# EAGLE design BCN3D++ (EAGLE 6.6.0)
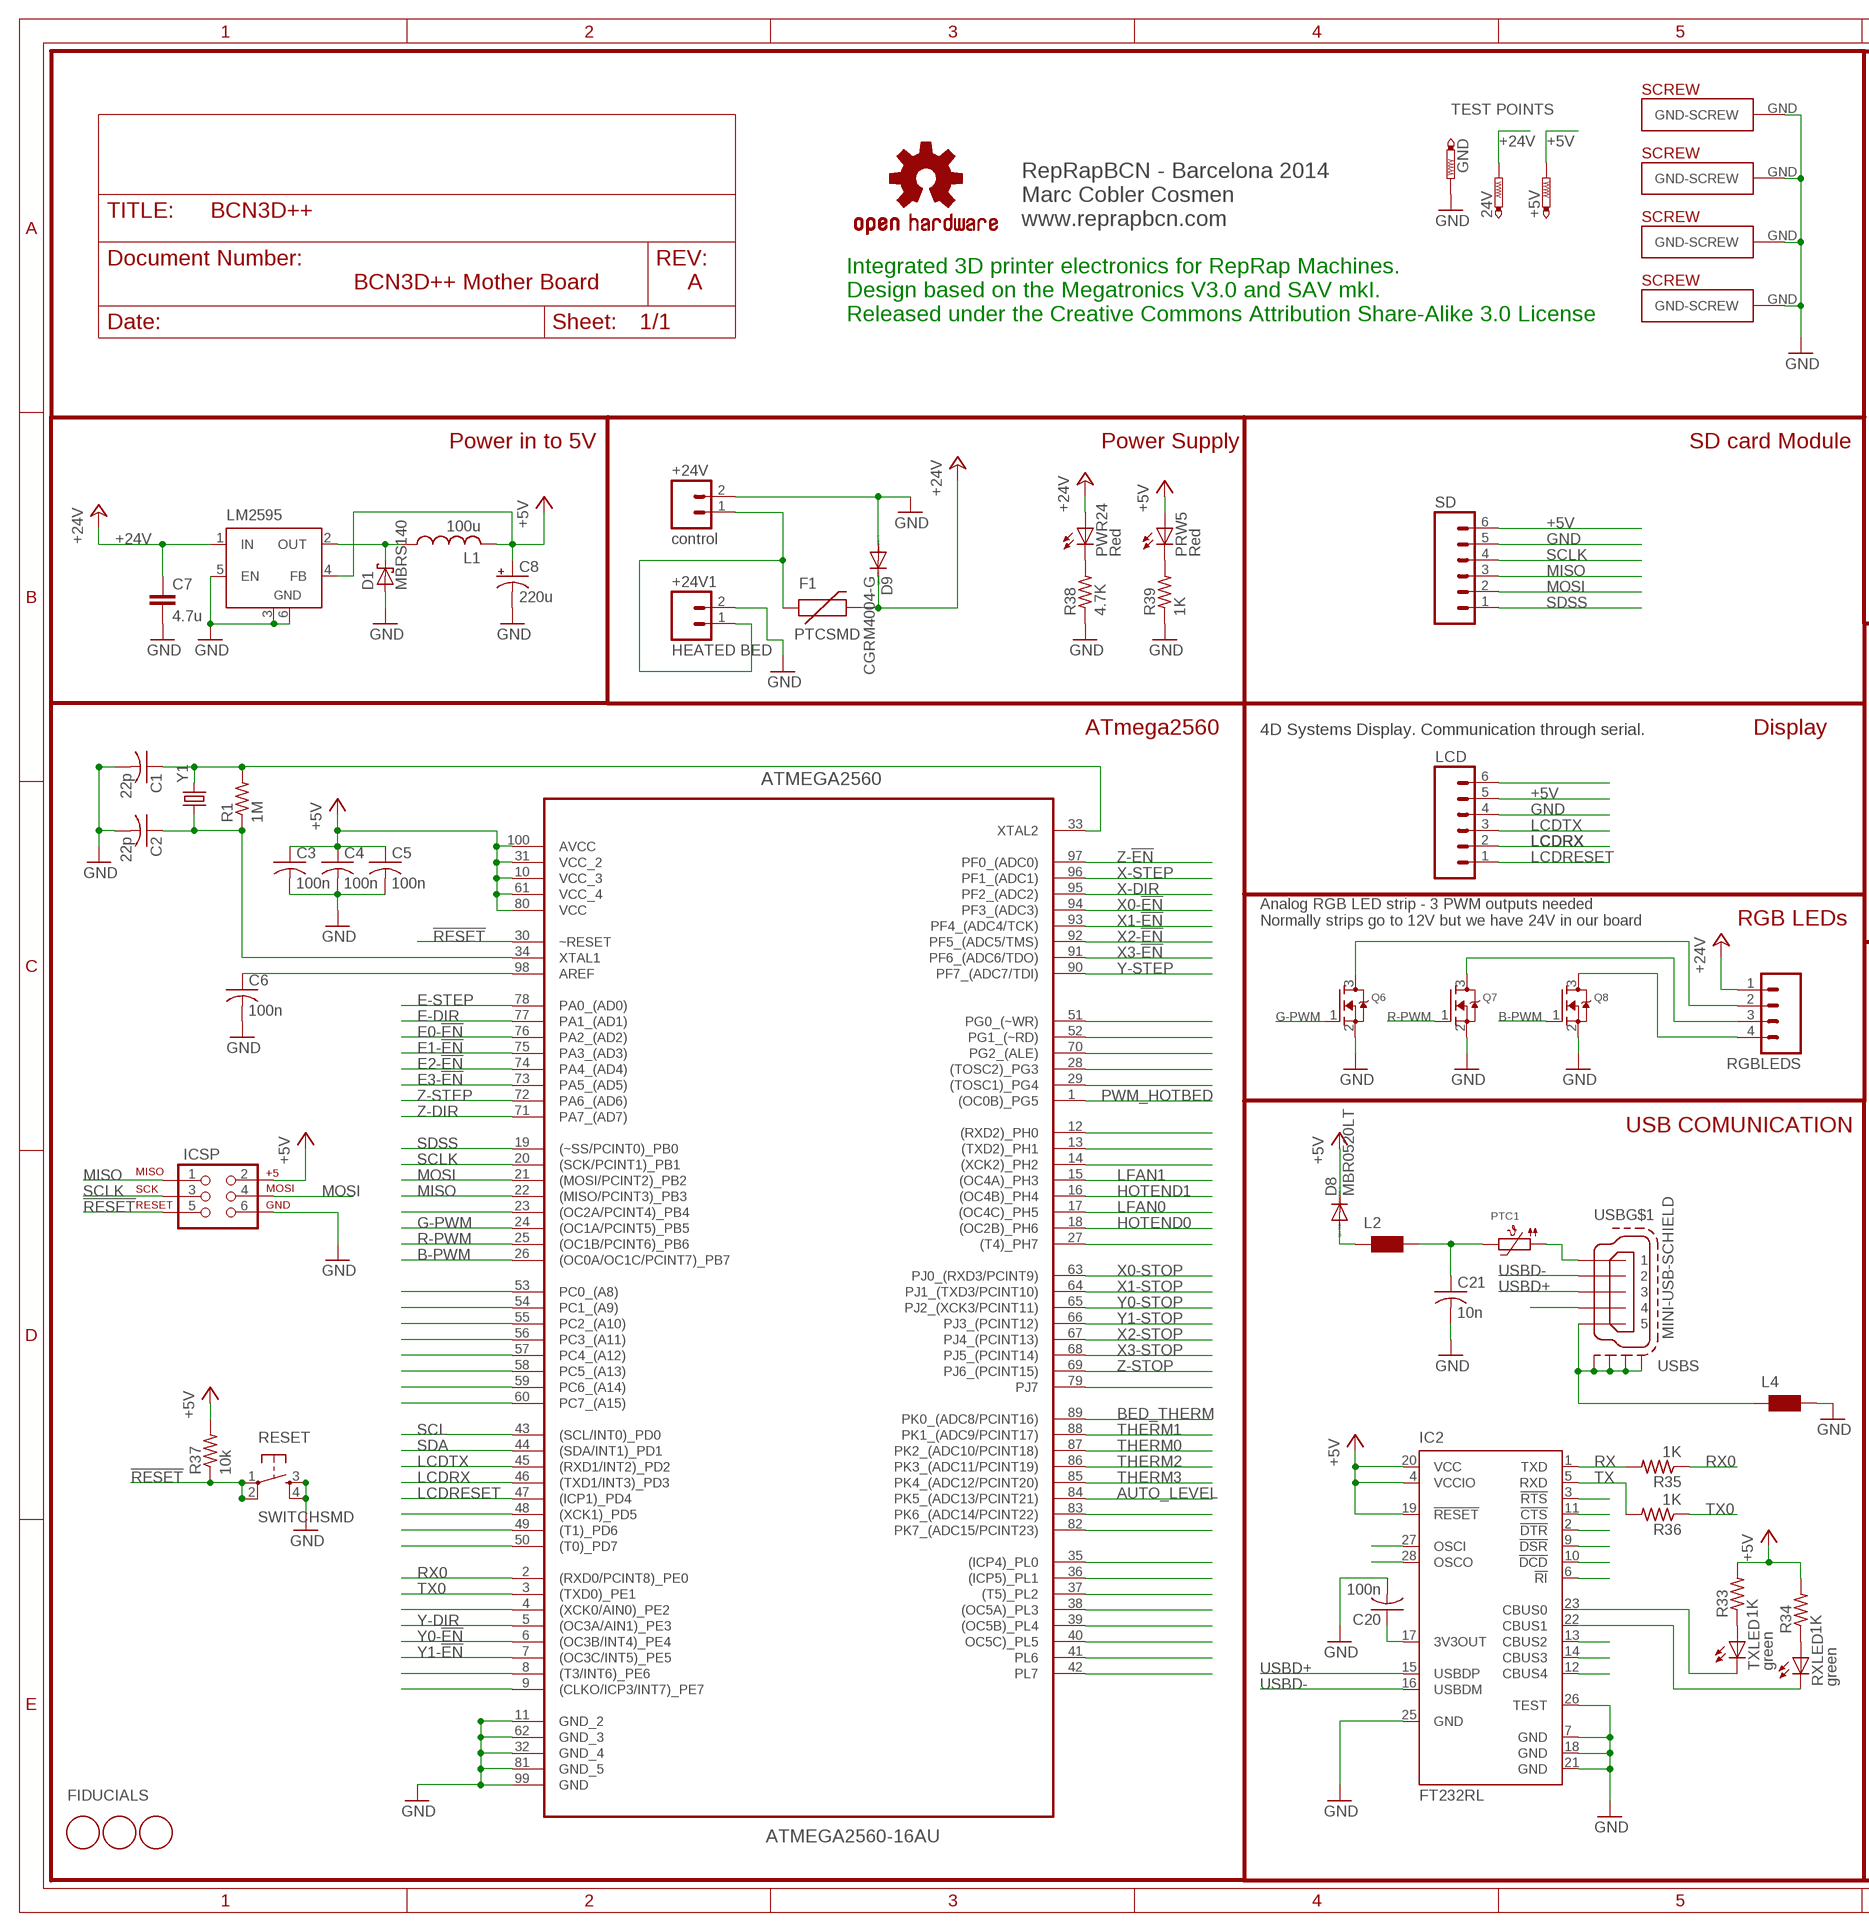
[diagram p0: schematic, sheet 1, part 1 of 2]
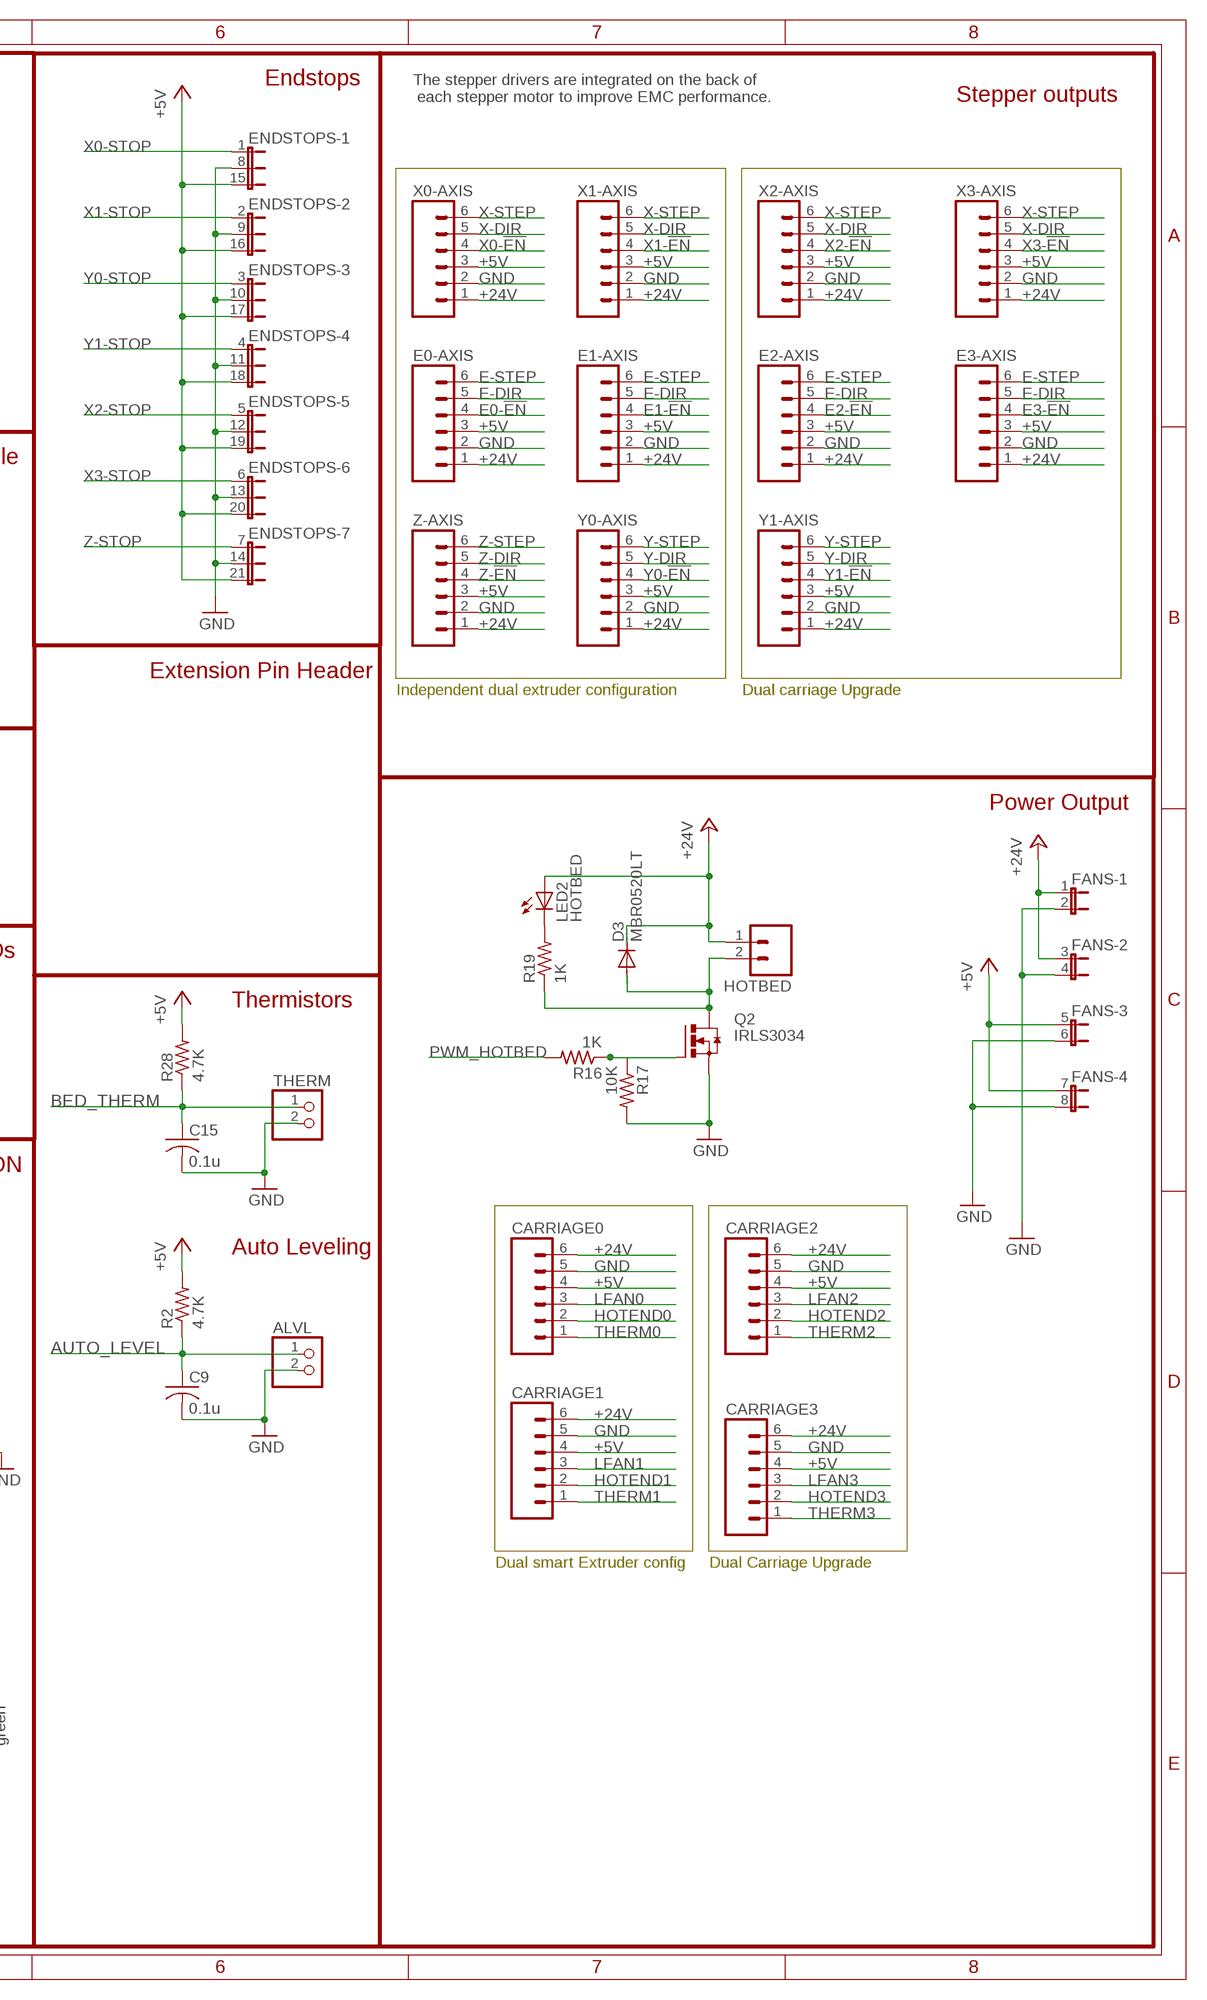
[diagram p1: schematic, sheet 1, part 2 of 2]

## Parts
24V  PTR1TP12SQ  [TP12SQ]
+5V  PTR1TP12SQ  [TP12SQ]
+24V  control  M025MM  [SCREWTERMINAL-5MM-2]
+24V1  HEATED BED  M025MM  [SCREWTERMINAL-5MM-2]
ALVL  PINHD-1X2  [1X02]
ATMEGA2560  ATMEGA2560-16AU  [QFP50P1600X1600X120-100N]
C1  22p  C-USC0805  [C0805]
C2  22p  C-USC0805  [C0805]
C3  100n  C-USC0805  [C0805]
C4  100n  C-USC0805  [C0805]
C5  100n  C-USC0805  [C0805]
C6  100n  C-USC0805  [C0805]
C7  4.7u  C-EUC1206K  [C1206K]
C8  220u  CPOL-USUD-8X10  [UD-8X10_NICHICON]
C9  0.1u  C-USC0805  [C0805]
C15  0.1u  C-USC0805  [C0805]
C20  100n  C-USC0805  [C0805]
C21  10n  C-USC0805K  [C0805K]
CARRIAGE0  M06SIP  [1X06]
CARRIAGE1  M06SIP  [1X06]
CARRIAGE2  M06SIP  [1X06]
CARRIAGE3  M06SIP  [1X06]
D1  MBRS140  SHOTTKY-DIODESMBRS140  [DO-214AA]
D3  MBR0520LT  [SOD123]
D8  MBR0520LT  [SOD123]
D9  CGRM4004-G  [SOD-123_MINI-SMA]
E0-AXIS  M06SIP  [1X06]
E1-AXIS  M06SIP  [1X06]
E2-AXIS  M06SIP  [1X06]
E3-AXIS  M06SIP  [1X06]
ENDSTOPS  PINCONNECTOR-7X3  [MALE-PIN-3X7]
F1  PTCSMD  [PTC-1206]
FANS  JP4QE  [JP4Q]
FID1  FIDUCIAL  [FIDUCIAL_1MM]
FID2  FIDUCIAL  [FIDUCIAL_1MM]
FID3  FIDUCIAL  [FIDUCIAL_1MM]
GND  PTR1TP12SQ  [TP12SQ]
HOTBED  M025MM  [SCREWTERMINAL-5MM-2]
IC2  FT232RL  [SSOP28]
ICSP  AVR_SPI_PRG_6NS  [2X3-NS]
L1  100u  INDUCTANCE  [SSR1260]
L2  WUERTH-ELEKTRONIK_WE-CBF_1206W  [WUERTH-ELEKTRONIK_1206W]
L4  WUERTH-ELEKTRONIK_WE-CBF_1206W  [WUERTH-ELEKTRONIK_1206W]
LCD  M06SIP  [1X06]
LED2  HOTBED  LEDCHIP-LED0603  [CHIP-LED0603]
LM2595  LM2596S  [TO263-5]
LOGO1  OSHW-LOGOM  [OSHW-LOGO-M]
PRW5  Red  LEDCHIP-LED0805  [CHIP-LED0805]
PTC1  MICROBUILDER_PTC1206_L  [MICROBUILDER_1206_PTC]
PWR24  Red  LEDCHIP-LED0805  [CHIP-LED0805]
Q2  IRLS3034  IRF3704S  [D2PACK]
Q6  MOSFET-NREFLOW  [SOT23]
Q7  MOSFET-NREFLOW  [SOT23]
Q8  MOSFET-NREFLOW  [SOT23]
R1  1M  R-US_R0805  [R0805]
R2  4.7K  R-US_M0805  [M0805]
R16  1K  R-US_M0805  [M0805]
R17  10K  R-US_M0805  [M0805]
R19  1K  R-US_M0805  [M0805]
R28  4.7K  R-US_M0805  [M0805]
R33  1K  R-US_M0805  [M0805]
R34  1K  R-US_M0805  [M0805]
R35  1K  R-US_M0805  [M0805]
R36  1K  R-US_M0805  [M0805]
R37  10k  R-US_M0805  [M0805]
R38  4.7K  R-US_R0805  [R0805]
R39  1K  R-US_R0805  [R0805]
RESET  SWITCHSMD  TAC_SWITCHSMD  [TACTILE-SWITCH-SMD]
RGBLEDS  M04PTH  [1X04]
RXLED  green  LEDCHIP-LED0603  [CHIP-LED0603]
SD  M06SIP  [1X06]
THERM  PINHD-1X2  [1X02]
TXLED  green  LEDCHIP-LED0603  [CHIP-LED0603]
U$1  SANGUINOLOLU_PLATED-SCREW  [SANGUINOLOLU_PLATEDSCREW]
U$2  SANGUINOLOLU_PLATED-SCREW  [SANGUINOLOLU_PLATEDSCREW]
U$3  SANGUINOLOLU_PLATED-SCREW  [SANGUINOLOLU_PLATEDSCREW]
U$4  SANGUINOLOLU_PLATED-SCREW  [SANGUINOLOLU_PLATEDSCREW]
USB  MINI-USB-SCHIELD  MINI-USB-SCHIELD-32005-201  [32005-201]
X0-AXIS  M06SIP  [1X06]
X1-AXIS  M06SIP  [1X06]
X2-AXIS  M06SIP  [1X06]
X3-AXIS  M06SIP  [1X06]
Y0-AXIS  M06SIP  [1X06]
Y1  CRYSTALHC49US  [HC49US]
Y1-AXIS  M06SIP  [1X06]
Z-AXIS  M06SIP  [1X06]

## Nets
11111: ATMEGA2560.23((OC2A/PCINT4)_PB4)
!RESET: ATMEGA2560.30(~RESET) ICSP.5 R37.1 RESET.1 RESET.2
+5V: +5V.TP ATMEGA2560.10(VCC_3) ATMEGA2560.31(VCC_2) ATMEGA2560.61(VCC_4) ATMEGA2560.80(VCC) ATMEGA2560.100(AVCC) C3.1 C4.1 C5.1 C8.+ CARRIAGE0.4 CARRIAGE1.4 CARRIAGE2.4 CARRIAGE3.4 D8.C E0-AXIS.3 E1-AXIS.3 E2-AXIS.3 E3-AXIS.3 ENDSTOPS.15 ENDSTOPS.16 ENDSTOPS.17 ENDSTOPS.18 ENDSTOPS.19 ENDSTOPS.20 ENDSTOPS.21 FANS.5 FANS.7 IC2.4(VCCIO) IC2.19(!RESET) IC2.20(VCC) ICSP.2 L1.B LCD.5 LM2595.4(FB) PRW5.A R2.2 R28.2 R33.2 R34.2 R37.2 SD.6 X0-AXIS.3 X1-AXIS.3 X2-AXIS.3 X3-AXIS.3 Y0-AXIS.3 Y1-AXIS.3 Z-AXIS.3
+24V: 24V.TP C7.1 CARRIAGE0.6 CARRIAGE1.6 CARRIAGE2.6 CARRIAGE3.6 D3.C D9.C E0-AXIS.1 E1-AXIS.1 E2-AXIS.1 E3-AXIS.1 F1.2 FANS.1 FANS.3 HOTBED.1 LED2.A LM2595.1(IN) PWR24.A RGBLEDS.1 X0-AXIS.1 X1-AXIS.1 X2-AXIS.1 X3-AXIS.1 Y0-AXIS.1 Y1-AXIS.1 Z-AXIS.1
AUTO_LEVEL: ALVL.1 ATMEGA2560.84(PK5_(ADC13/PCINT21)) C9.1 R2.1
B-PWM: ATMEGA2560.26((OC0A/OC1C/PCINT7)_PB7) Q8.1(G)
BED_THERM: ATMEGA2560.89(PK0_(ADC8/PCINT16)) C15.1 R28.1 THERM.1
E0-!EN: ATMEGA2560.76(PA2_(AD2)) E0-AXIS.4
E1-!EN: ATMEGA2560.75(PA3_(AD3)) E1-AXIS.4
E2-!EN: ATMEGA2560.74(PA4_(AD4)) E2-AXIS.4
E3-!EN: ATMEGA2560.73(PA5_(AD5)) E3-AXIS.4
E-DIR: ATMEGA2560.77(PA1_(AD1)) E0-AXIS.5 E1-AXIS.5 E2-AXIS.5 E3-AXIS.5
E-STEP: ATMEGA2560.78(PA0_(AD0)) E0-AXIS.6 E1-AXIS.6 E2-AXIS.6 E3-AXIS.6
G-PWM: ATMEGA2560.24((OC1A/PCINT5)_PB5) Q6.1(G)
GND: +24V1.2 +24V.2 ALVL.2 ATMEGA2560.11(GND_2) ATMEGA2560.32(GND_4) ATMEGA2560.62(GND_3) ATMEGA2560.81(GND_5) ATMEGA2560.99(GND) C1.2 C2.2 C3.2 C4.2 C5.2 C6.2 C7.2 C8.- C9.2 C15.2 C20.2 C21.2 CARRIAGE0.5 CARRIAGE1.5 CARRIAGE2.5 CARRIAGE3.5 D1.A D9.A E0-AXIS.2 E1-AXIS.2 E2-AXIS.2 E3-AXIS.2 ENDSTOPS.8 ENDSTOPS.9 ENDSTOPS.10 ENDSTOPS.11 ENDSTOPS.12 ENDSTOPS.13 ENDSTOPS.14 FANS.2 FANS.4 FANS.6 FANS.8 GND.TP IC2.7(GND) IC2.18(GND) IC2.21(GND) IC2.25(GND) IC2.26(TEST) ICSP.6 L4.2 LCD.4 LM2595.3(GND) LM2595.5(EN) LM2595.6(GND) Q2.3(S) Q6.2(S) Q7.2(S) Q8.2(S) R17.2 R38.1 R39.1 RESET.3 RESET.4 SD.5 THERM.2 U$1.GND(GND-SCREW) U$2.GND(GND-SCREW) U$3.GND(GND-SCREW) U$4.GND(GND-SCREW) X0-AXIS.2 X1-AXIS.2 X2-AXIS.2 X3-AXIS.2 Y0-AXIS.2 Y1-AXIS.2 Z-AXIS.2
HOTEND0: ATMEGA2560.18((OC2B)_PH6) CARRIAGE0.2
HOTEND1: ATMEGA2560.16((OC4B)_PH4) CARRIAGE1.2
HOTEND2: CARRIAGE2.2
HOTEND3: CARRIAGE3.2
LCDRESET: ATMEGA2560.47((ICP1)_PD4) LCD.1
LCDRX: ATMEGA2560.46((TXD1/INT3)_PD3) LCD.2
LCDTX: ATMEGA2560.45((RXD1/INT2)_PD2) LCD.3
LFAN0: ATMEGA2560.17((OC4C)_PH5) CARRIAGE0.3
LFAN1: ATMEGA2560.15((OC4A)_PH3) CARRIAGE1.3
LFAN2: CARRIAGE2.3
LFAN3: CARRIAGE3.3
MISO: ATMEGA2560.22((MISO/PCINT3)_PB3) ICSP.1 SD.3
MOSI: ATMEGA2560.21((MOSI/PCINT2)_PB2) ICSP.4 SD.2
N$1: ATMEGA2560.33(XTAL2) C1.1 R1.2 Y1.2
N$2: ATMEGA2560.98(AREF) C6.1
N$3: ATMEGA2560.34(XTAL1) C2.1 R1.1 Y1.1
N$4: D1.C L1.A LM2595.2(OUT)
N$5: C21.1 L2.2 PTC1.2
N$6: IC2.23(CBUS0) TXLED.C
N$7: IC2.22(CBUS1) RXLED.C
N$8: IC2.3(!RTS)
N$9: Q6.3(D) RGBLEDS.2
N$10: Q7.3(D) RGBLEDS.3
N$11: Q8.3(D) RGBLEDS.4
N$12: IC2.11(!CTS)
N$13: IC2.2(!DTR)
N$14: IC2.9(!DSR)
N$15: IC2.10(!DCD)
N$16: IC2.6(!RI)
N$17: IC2.13(CBUS2)
N$18: IC2.14(CBUS3)
N$19: IC2.12(CBUS4)
N$20: IC2.27(OSCI)
N$21: IC2.28(OSCO)
N$22: USB.4
N$24: LCD.6
N$25: +24V1.1 +24V.1 F1.1
N$63: Q2.1(G) R16.1 R17.1
N$66: D3.A HOTBED.2 Q2.2(D) R19.1
N$69: LED2.C R19.2
N$76: C20.1 IC2.17(3V3OUT)
N$81: R33.1 TXLED.A
N$82: R34.1 RXLED.A
N$83: D8.A L2.1
N$84: PTC1.1 USB.1
N$91: ATMEGA2560.53(PC0_(A8))
N$92: ATMEGA2560.54(PC1_(A9))
N$93: ATMEGA2560.55(PC2_(A10))
N$94: ATMEGA2560.56(PC3_(A11))
N$95: ATMEGA2560.57(PC4_(A12))
N$96: ATMEGA2560.58(PC5_(A13))
N$97: ATMEGA2560.59(PC6_(A14))
N$98: ATMEGA2560.60(PC7_(A15))
N$104: ATMEGA2560.48((XCK1)_PD5)
N$105: ATMEGA2560.49((T1)_PD6)
N$106: ATMEGA2560.50((T0)_PD7)
N$109: ATMEGA2560.4((XCK0/AIN0)_PE2)
N$113: ATMEGA2560.8((T3/INT6)_PE6)
N$114: ATMEGA2560.9((CLKO/ICP3/INT7)_PE7)
N$123: ATMEGA2560.51(PG0_(~WR))
N$124: ATMEGA2560.52(PG1_(~RD))
N$125: ATMEGA2560.70(PG2_(ALE))
N$126: ATMEGA2560.28((TOSC2)_PG3)
N$127: ATMEGA2560.29((TOSC1)_PG4)
N$129: ATMEGA2560.12((RXD2)_PH0)
N$130: ATMEGA2560.13((TXD2)_PH1)
N$131: ATMEGA2560.14((XCK2)_PH2)
N$136: ATMEGA2560.27((T4)_PH7)
N$144: ATMEGA2560.79(PJ7)
N$151: ATMEGA2560.83(PK6_(ADC14/PCINT22))
N$152: ATMEGA2560.82(PK7_(ADC15/PCINT23))
N$153: ATMEGA2560.35((ICP4)_PL0)
N$154: ATMEGA2560.36((ICP5)_PL1)
N$155: ATMEGA2560.37((T5)_PL2)
N$156: ATMEGA2560.38((OC5A)_PL3)
N$157: ATMEGA2560.39((OC5B)_PL4)
N$158: ATMEGA2560.40(OC5C)_PL5)
N$159: ATMEGA2560.41(PL6)
N$160: ATMEGA2560.42(PL7)
N$161: PWR24.C R38.2
N$162: PRW5.C R39.2
PWM_HOTBED: ATMEGA2560.1((OC0B)_PG5) R16.2
R-PWM: ATMEGA2560.25((OC1B/PCINT6)_PB6) Q7.1(G)
RX: IC2.1(TXD) R35.2
RX0: ATMEGA2560.2((RXD0/PCINT8)_PE0) R35.1
SCL: ATMEGA2560.43((SCL/INT0)_PD0)
SCLK: ATMEGA2560.20((SCK/PCINT1)_PB1) ICSP.3 SD.4
SDA: ATMEGA2560.44((SDA/INT1)_PD1)
SDSS: ATMEGA2560.19((~SS/PCINT0)_PB0) SD.1
THERM0: ATMEGA2560.87(PK2_(ADC10/PCINT18)) CARRIAGE0.1
THERM1: ATMEGA2560.88(PK1_(ADC9/PCINT17)) CARRIAGE1.1
THERM2: ATMEGA2560.86(PK3_(ADC11/PCINT19)) CARRIAGE2.1
THERM3: ATMEGA2560.85(PK4_(ADC12/PCINT20)) CARRIAGE3.1
TX: IC2.5(RXD) R36.2
TX0: ATMEGA2560.3((TXD0)_PE1) R36.1
USBD+: IC2.15(USBDP) USB.3
USBD-: IC2.16(USBDM) USB.2
USBSHIELD: L4.1 USB.5 USB.M1(S:S1) USB.M2(S:S2) USB.M3(S:S3) USB.M4(S:S4)
X0-!EN: ATMEGA2560.94(PF3_(ADC3)) X0-AXIS.4
X0-STOP: ATMEGA2560.63(PJ0_(RXD3/PCINT9)) ENDSTOPS.1
X1-!EN: ATMEGA2560.93(PF4_(ADC4/TCK)) X1-AXIS.4
X1-STOP: ATMEGA2560.64(PJ1_(TXD3/PCINT10)) ENDSTOPS.2
X2-!EN: ATMEGA2560.92(PF5_(ADC5/TMS)) X2-AXIS.4
X2-STOP: ATMEGA2560.67(PJ4_(PCINT13)) ENDSTOPS.5
X3-!EN: ATMEGA2560.91(PF6_(ADC6/TDO)) X3-AXIS.4
X3-STOP: ATMEGA2560.68(PJ5_(PCINT14)) ENDSTOPS.6
X-DIR: ATMEGA2560.95(PF2_(ADC2)) X0-AXIS.5 X1-AXIS.5 X2-AXIS.5 X3-AXIS.5
X-STEP: ATMEGA2560.96(PF1_(ADC1)) X0-AXIS.6 X1-AXIS.6 X2-AXIS.6 X3-AXIS.6
Y0-!EN: ATMEGA2560.6((OC3B/INT4)_PE4) Y0-AXIS.4
Y0-STOP: ATMEGA2560.65(PJ2_(XCK3/PCINT11)) ENDSTOPS.3
Y1-!EN: ATMEGA2560.7((OC3C/INT5)_PE5) Y1-AXIS.4
Y1-STOP: ATMEGA2560.66(PJ3_(PCINT12)) ENDSTOPS.4
Y-DIR: ATMEGA2560.5((OC3A/AIN1)_PE3) Y0-AXIS.5 Y1-AXIS.5
Y-STEP: ATMEGA2560.90(PF7_(ADC7/TDI)) Y0-AXIS.6 Y1-AXIS.6
Z-!EN: ATMEGA2560.97(PF0_(ADC0)) Z-AXIS.4
Z-DIR: ATMEGA2560.71(PA7_(AD7)) Z-AXIS.5
Z-STEP: ATMEGA2560.72(PA6_(AD6)) Z-AXIS.6
Z-STOP: ATMEGA2560.69(PJ6_(PCINT15)) ENDSTOPS.7

## Notes on the sheet
- Endstops
- The stepper drivers are integrated on the back of
   each stepper motor to improve EMC performance.
- Stepper outputs
- TEST POINTS
- RepRapBCN - Barcelona 2014
  Marc Cobler Cosmen
  www.reprapbcn.com
- Integrated 3D printer electronics for RepRap Machines.
- BCN3D++ Mother Board | A
- Design based on the Megatronics V3.0 and SAV mkI.
  Released under the Creative Commons Attribution Share-Alike 3.0 License
- Power in to 5V | Power Supply | SD card Module
- Extension Pin Header
- Independent dual extruder configuration | Dual carriage Upgrade
- ATmega2560 | 4D Systems Display. Communication through serial. | Display
- Power Output
- Analog RGB LED strip - 3 PWM outputs needed
  Normally strips go to 12V but we have 24V in our board
- RGB LEDs
- Thermistors
- USB COMUNICATION
- Auto Leveling
- Dual smart Extruder config | Dual Carriage Upgrade
- FIDUCIALS

## Library data of the parts
24V +5V GND = testpad:PTR1: TEST PIN
+24V +24V1 HOTBED = SparkFun-Connectors:M02: Standard 2-pin 0.1" header. Use with - straight break away headers ( PRT-00116) - right angle break away headers (PRT-00553) - swiss pins (PRT-00743) - machine pins (PRT-00117) - female headers (PRT-00115) Molex polarized connector foot print use with: PRT-08233 with associated crimp pins and housings. 2.54_SCREWTERM for use with PRT-10571. 3.5mm Screw Terminal footprints for PRT-08084 5mm Screw Terminal footprints for use with PRT-08432; STOREFRONT_ID: PRT-08432
ALVL THERM = pinhead:PINHD-1X2: PIN HEADER
ATMEGA2560 = Atmel_By_element14_Batch_1-00:ATMEGA2560-16AU: Microcontroller; DESCRIPTION: Microcontroller; MPN: ATMEGA2560-16AU; OC_FARNELL: 1288330; OC_NEWARK: 23M5051; PACKAGE: LQFP-100; SUPPLIER: ATMEL
C1 C2 = resistor:C-US: CAPACITOR, American symbol
C3-C6 C9 C15 C20 = rcl:C-US: CAPACITOR, American symbol
C7 = rcl:C-EU: CAPACITOR, European symbol
C8 = rcl:CPOL-US: POLARIZED CAPACITOR, American symbol
C21 = adafruit:C-US: CAPACITOR, American symbol
CARRIAGE0 CARRIAGE1-CARRIAGE3 E0-AXIS E1-AXIS E2-AXIS E3-AXIS LCD SD X0-AXIS X1-AXIS X2-AXIS X3-AXIS Y0-AXIS Y1-AXIS Z-AXIS = MarcEagleParts:M06: Header 6 Standard 6-pin 0.1" header. Use with straight break away headers (SKU : PRT-00116), right angle break away headers (PRT-00553), swiss pins (PRT-00743), machine pins (PRT-00117), and female headers (PRT-00115). Molex polarized connector foot print use with SKU : PRT-08094 with associated crimp pins and housings. NOTES ON THE VARIANTS LOCK and LOCK_LONGPADS... This footprint was designed to help hold the alignment of a through-hole component (i.e. 6-pin header) while soldering it into place. You may notice that each hole has been shifted either up or down by 0.005 of an inch from it's more standard position (which is a perfectly straight line). This slight alteration caused the pins (the squares in the middle) to touch the edges of the holes. Because they are alternating, it causes a "brace" to hold the component in place. 0.005 has proven to be the perfect amount of "off-center" position when using our standard breakaway headers. Although looks a little odd when you look at the bare footprint, once you have a header in there, the alteration is very hard to notice. Also,if you push a header all the way into place, it is covered up entirely on the bottom side. This idea of altering the position of holes to aid alignment will be further integrated into the Sparkfun Library for other footprints. It can help hold any component with 3 or more connection pins.
D1 = MarcEagleParts:SHOTTKY-DIODES: Shottky Diodes SMT DO-214AA: 1A 40V SMA 403D-02
D3 D8 = diode:MBR0520LT: SCHOTTKY BARRIER RECTIFIER Source: http://onsemi.com .. MBR0520LT1-D.pdf
D9 = diode:CGRM400*-G: Molded plasitc,JEDEC SOD-123/Mini SMA Source: Comchip CGRM4001-G.pdf
ENDSTOPS = MarcEagleParts:PINCONNECTOR-7X3: JUMPER
F1 = SparkFun-PowerIC:PTC: Resettable Fuse PTC Resettable Fuse. Spark Fun Electronics SKU : COM-08357; PROD_ID: RES-11150
FANS = jumper:JP4QE: JUMPER
FID1-FID3 = adafruit:FIDUCIAL: For use by pick and place machines to calibrate the vision/machine, 1mm By microbuilder.eu
IC2 = ftdichip:FT232R: Source: http://www.ftdichip.com/Documents/DataSheets/DS_FT232R_v104.pdf; MPN: FT232RL; OC_FARNELL: 1146032; OC_NEWARK: 91K9918
ICSP = SparkFun-Connectors:AVR_SPI_PRG_6: AVR ISP 6 Pin This is the reduced ISP connector for AVR programming. Common on Arduino. This footprint will take up less PCB space and can be used with a 10-pin to 6-pin adapter such as SKU: BOB-08508 **Special note about "TEST_POINT" package. The stop mask is on the top side, so if you want your programming test points to be on the bottom of your board, make sure to place this package on the bottom side of the board. This also ensure that the orientation to program from the bottom side will be correct.
L1 = MarcEagleParts:INDUCTANCE: INDUCTOR, American symbol
L2 L4 = SAV MK-I:WUERTH-ELEKTRONIK_WE-CBF: SMD EMI Suppression Ferrite Beads - excellent anti-EMI properties - low DCR - impedances till 3000 ohms - rated current up to 6 A
LED2 PRW5 PWR24 RXLED TXLED = adafruit:LED: LED OSRAM: - CHIPLED LG R971, LG N971, LY N971, LG Q971, LY Q971, LO R971, LY R971 LH N974, LH R974 LS Q976, LO Q976, LY Q976 LO Q996 - Hyper CHIPLED LW Q18S LB Q993, LB Q99A, LB R99A - SideLED LS A670, LO A670, LY A670, LG A670, LP A670 LB A673, LV A673, LT A673, LW A673 LH A674 LY A675 LS A676, LA A676, LO A676, LY A676, LW A676 LS A679, LY A679, LG A679 - Hyper Micro SIDELED® LS Y876, LA Y876, LO Y876, LY Y876 LT Y87S - SmartLED LW L88C, LW L88S LB L89C, LB L89S, LG L890 LS L89K, LO L89K, LY L89K LS L896, LA L896, LO L896, LY L896 - TOPLED LS T670, LO T670, LY T670, LG T670, LP T670 LSG T670, LSP T670, LSY T670, LOP T670, LYG T670 LG T671, LOG T671, LSG T671 LB T673, LV T673, LT T673, LW T673 LH T674 LS T676, LA T676, LO T676, LY T676, LB T676, LH T676, LSB T676, LW T676 LB T67C, LV T67C, LT T67C, LS T67K, LO T67K, LY T67K, LW E67C LS E67B, LA E67B, LO E67B, LY E67B, LB E67C, LV E67C, LT E67C LW T67C LS T679, LY T679, LG T679 LS T770, LO T770, LY T770, LG T770, LP T770 LB T773, LV T773, LT T773, LW T773 LH T774 LS E675, LA E675, LY E675, LS T675 LS T776, LA T776, LO T776, LY T776, LB T776 LHGB T686 LT T68C, LB T68C - Hyper Mini TOPLED® LB M676 - Mini TOPLED Santana® LG M470 LS M47K, LO M47K, LY M47K Source: http://www.osram.convergy.de/
LM2595 = linear:LM2596S: STEP-DOWN VOLTAGE REGULATOR
LOGO1 = SparkFun-Aesthetics:OSHW-LOGO: Open Source Hardware Logo This logo indicates the piece of hardware it is found on incorporates a OSHW license and/or adheres to the definition of open source hardware found here: http://freedomdefined.org/OSHW
PTC1 = SAV MK-I:MICROBUILDER_PTC: PTC (Resettable Fuse) 1206 Package 250mA PTC (16V Max, Time-to-Trip: 0.08s) - Digikey: F2110CT-ND 1210 Package 100mA PTC (30V Max, Time-to-Trip: 0.6s) - Digikey: MF-USMF010-2CT-ND 1812 Package 750mA PTC (24V Max, Time-to-Trip: 0.2s) - Digikey: MF-MSMF075/24-2CT-ND
Q2 = transistor-power:IRF3704: SMPS MOSFET HEXFET® Power MOSFET Source: http://www.irf.com/product-info/datasheets/data/irf3704.pdf
Q6-Q8 = adafruit:MOSFET-N: N-Channel Mosfet 2N7002E - 60V 260mA SOT23 [Digikey: 2N7002ET1GOSTR-ND] - REEL BSH103 - 30V 850mA SOT23 [Digikey: 568-5013-1-ND]
R1 = resistor:R-US_: RESISTOR, American symbol
R2 R16 R17 R19 R28 R33-R36 R38 R39 = rcl:R-US_: RESISTOR, American symbol
R37 = adafruit:R-US_: RESISTOR, American symbol
RESET = SparkFun-Electromechanical:TAC_SWITCH: Momentary Switch Button commonly used for reset or general input. Spark Fun Electronics SKU : COM-00097 SMT- SWCH-08247; PROD_ID: SWCH-08247; VALUE: TAC_SWITCHSMD
RGBLEDS = SparkFun-Connectors:M04: Header 4 Standard 4-pin 0.1" header. Use with straight break away headers (SKU : PRT-00116), right angle break away headers (PRT-00553), swiss pins (PRT-00743), machine pins (PRT-00117), and female headers (PRT-00115). Molex polarized connector foot print use with SKU : PRT-08231 with associated crimp pins and housings. 1MM SMD Version SKU: PRT-10208
U$1-U$4 = SAV MK-I:SANGUINOLOLU_PLATED-SCREW
USB = con-cypressindustries:MINI-USB-SCHIELD-: MINI USB-B Conector Source: www.cypressindustries.com; OC_FARNELL: unknown; OC_NEWARK: unknown
Y1 = SparkFun-FreqCtrl:CRYSTAL: Various standard crystals. Proven footprints. Spark Fun Electronics SKU : COM-00534

## Board
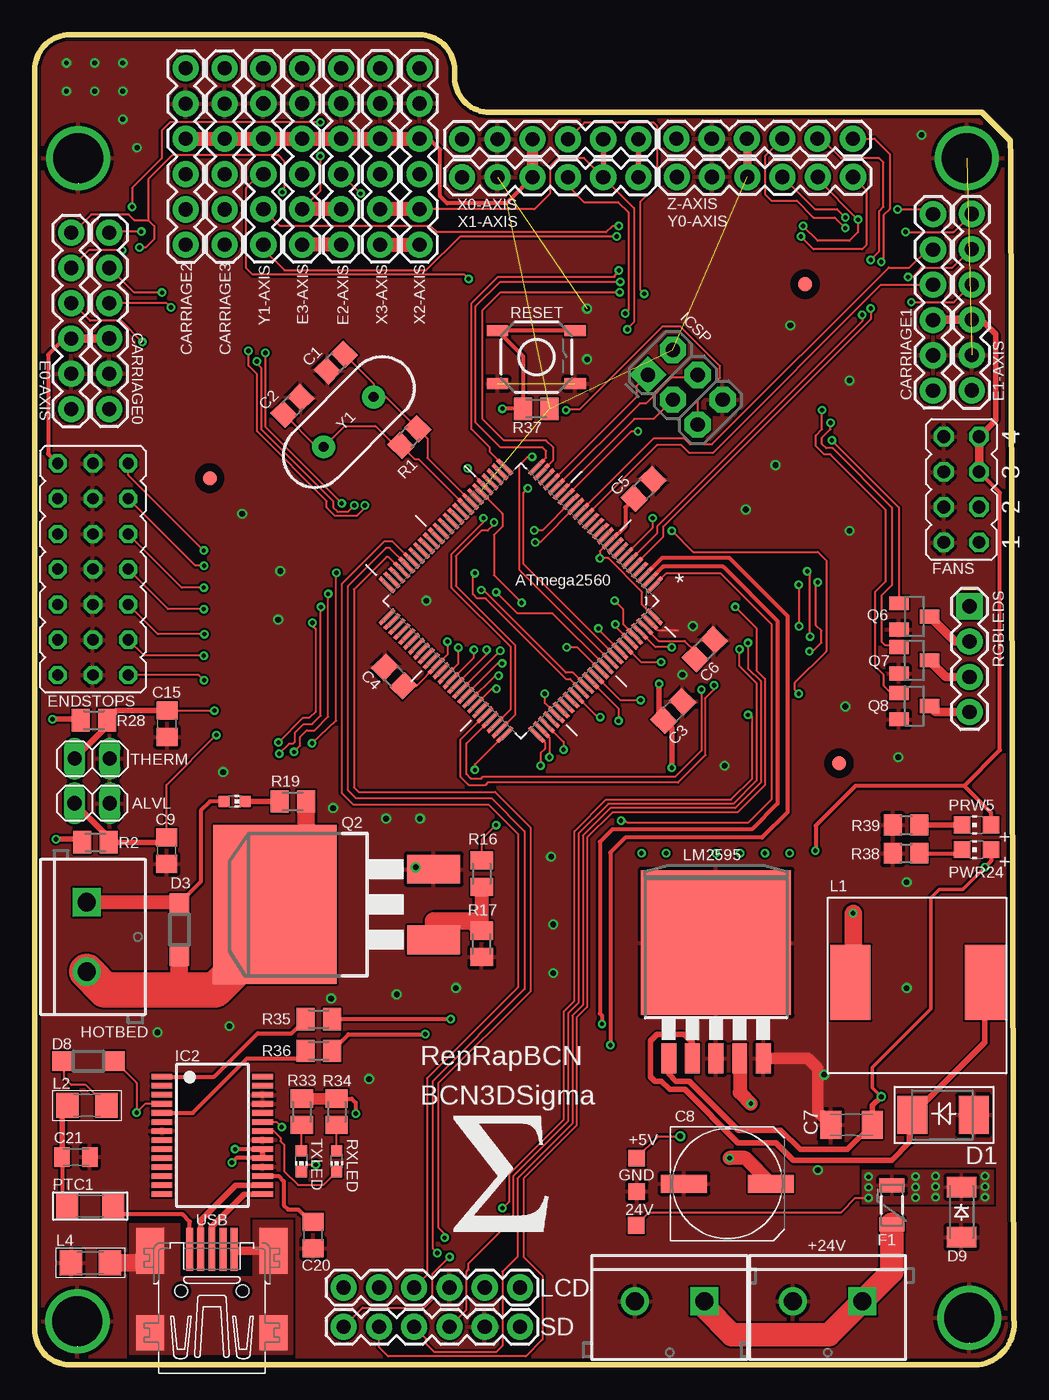
[diagram p2: board, top side]
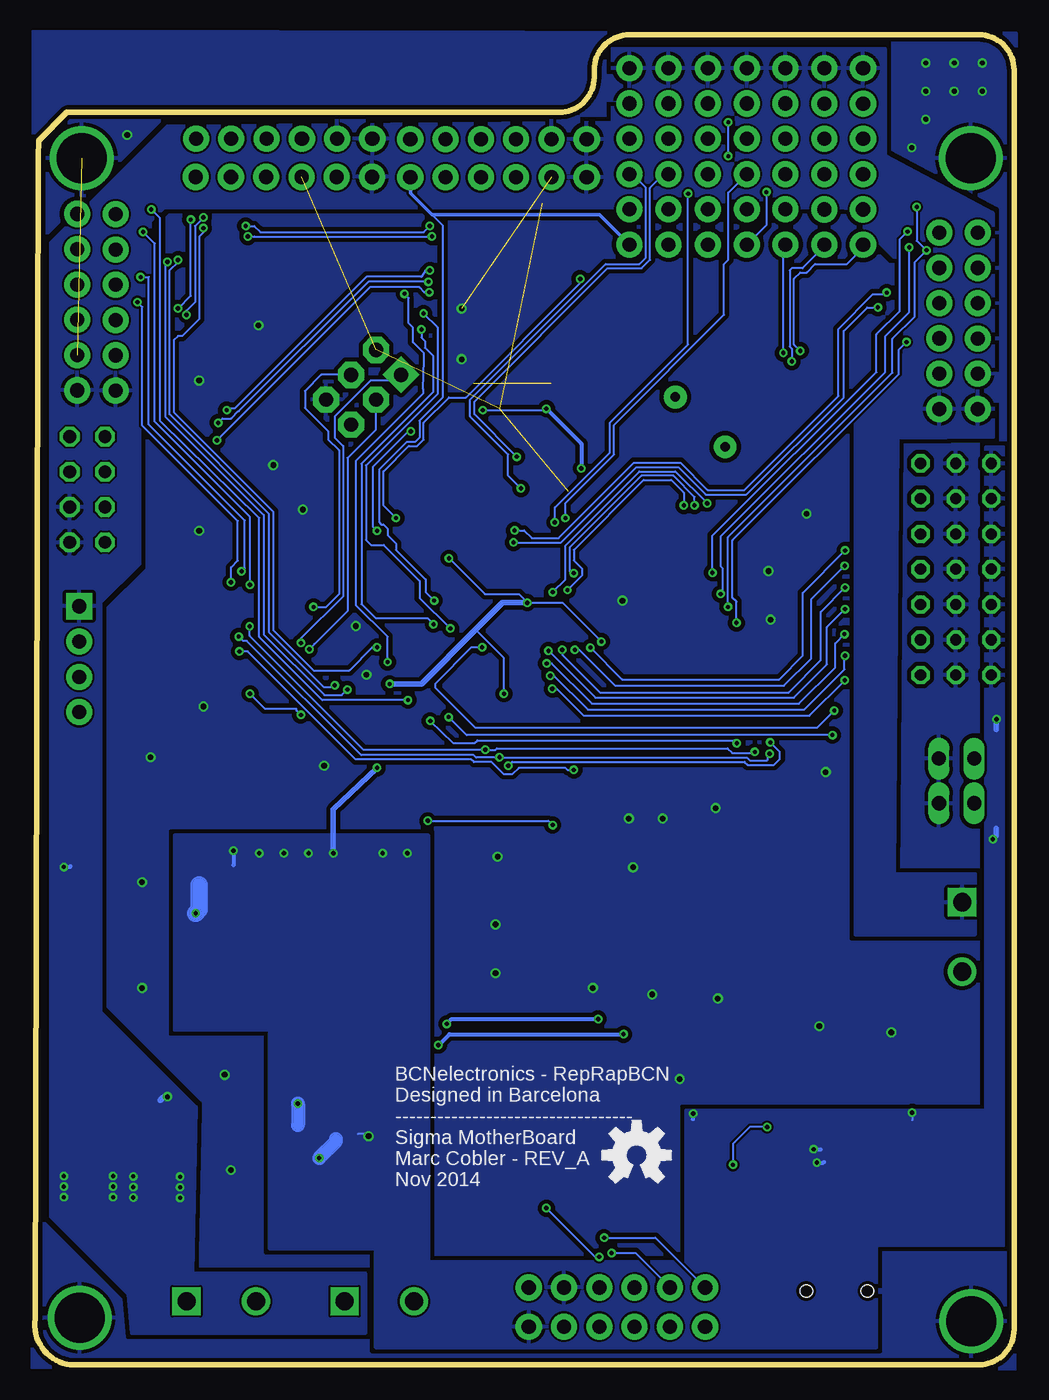
[diagram p3: board, bottom side, seen from below]

Size 70.52 x 95.76 mm. Coordinates in mm from the lower left corner, seen from the top.
Outline: 70.27,86.97 70.49,3.3 arc-90 67.95,0 2.54,0 arc-90 0,2.54 0,93.22 arc-90 2.54,95.76 27.69,95.76 arc-90 30.23,93.22 30.23,92.71 arc90 32.77,90.17 68.2,90.17 70.23,88.14
Outline: 70.24,88.11 70.27,86.98
Copper layers (1*16): Top 0.035mm / dielectric 1.5mm / Bottom 0.035mm
Design rules "ITEADstudio_DRC": minimum track width 6mil, minimum drill 12mil, track to track 6mil, track to pad 6mil, pad to pad 6mil, via to via 6mil, smd to smd 0mil, copper to edge 10mil, drill to drill 10mil, minimum pad ring 10mil, minimum via ring 6mil, stop-mask expansion 2mil, vias tented up to drill 100mil, thermal gap 10mil

### Footprints (pad centres in the part's own frame; a part is rotated, then mirrored left to right if it is on the bottom)
TP12SQ = smd 1.2 x 1.2: TP 0,0
SCREWTERMINAL-5MM-2 = drill 1.3 pad 2.032 square: 1 0,0 | drill 1.3 pad 2.032: 2 5,0
1X02 = drill 1.016 long: 1 -1.27,0; 2 1.27,0
QFP50P1600X1600X120-100N = smd 1.473 x 0.279: 1 -7.62,5.994; 2 -7.62,5.512; 3 -7.62,5.004; 4 -7.62,4.496; 5 -7.62,3.988; 6 -7.62,3.505; 7 -7.62,2.997; 8 -7.62,2.489; 9 -7.62,2.007; 10 -7.62,1.499; 11 -7.62,0.991; 12 -7.62,0.508; 13 -7.62,0; 14 -7.62,-0.508; 15 -7.62,-0.991; 16 -7.62,-1.499; 17 -7.62,-2.007; 18 -7.62,-2.489; 19 -7.62,-2.997; 20 -7.62,-3.505; 21 -7.62,-3.988; 22 -7.62,-4.496; 23 -7.62,-5.004; 24 -7.62,-5.512; 25 -7.62,-5.994; 51 7.62,-5.994; 52 7.62,-5.512; 53 7.62,-5.004; 54 7.62,-4.496; 55 7.62,-3.988; 56 7.62,-3.505; 57 7.62,-2.997; 58 7.62,-2.489; 59 7.62,-2.007; 60 7.62,-1.499; 61 7.62,-0.991; 62 7.62,-0.508; 63 7.62,0; 64 7.62,0.508; 65 7.62,0.991; 66 7.62,1.499; 67 7.62,2.007; 68 7.62,2.489; 69 7.62,2.997; 70 7.62,3.505; 71 7.62,3.988; 72 7.62,4.496; 73 7.62,5.004; 74 7.62,5.512; 75 7.62,5.994 | smd 0.279 x 1.473: 26 -5.994,-7.62; 27 -5.512,-7.62; 28 -5.004,-7.62; 29 -4.496,-7.62; 30 -3.988,-7.62; 31 -3.505,-7.62; 32 -2.997,-7.62; 33 -2.489,-7.62; 34 -2.007,-7.62; 35 -1.499,-7.62; 36 -0.991,-7.62; 37 -0.508,-7.62; 38 0,-7.62; 39 0.508,-7.62; 40 0.991,-7.62; 41 1.499,-7.62; 42 2.007,-7.62; 43 2.489,-7.62; 44 2.997,-7.62; 45 3.505,-7.62; 46 3.988,-7.62; 47 4.496,-7.62; 48 5.004,-7.62; 49 5.512,-7.62; 50 5.994,-7.62; 76 5.994,7.62; 77 5.512,7.62; 78 5.004,7.62; 79 4.496,7.62; 80 3.988,7.62; 81 3.505,7.62; 82 2.997,7.62; 83 2.489,7.62; 84 2.007,7.62; 85 1.499,7.62; 86 0.991,7.62; 87 0.508,7.62; 88 0,7.62; 89 -0.508,7.62; 90 -0.991,7.62; 91 -1.499,7.62; 92 -2.007,7.62; 93 -2.489,7.62; 94 -2.997,7.62; 95 -3.505,7.62; 96 -3.988,7.62; 97 -4.496,7.62; 98 -5.004,7.62; 99 -5.512,7.62; 100 -5.994,7.62
C0805 = smd 1.3 x 1.5: 1 -0.85,0; 2 0.85,0
C0805' = smd 1.3 x 1.5: 1 -0.95,0; 2 0.95,0
C1206K = smd 1.5 x 2: 1 -1.5,0; 2 1.5,0
UD-8X10_NICHICON = smd 3.3 x 1.3: + 3.125,0; - -3.125,0
C0805K = smd 1.1 x 1.4: 1 -1,0; 2 1,0
1X06 = drill 1.016 pad 1.88: 1 0,0; 2 2.54,0; 3 5.08,0; 4 7.62,0; 5 10.16,0; 6 12.7,0
DO-214AA = smd 2.159 x 2.743: A 4.42,0; C 0,0
SOD123 = smd 1.4 x 1.4: A 1.9,0; C -1.9,0
SOD-123_MINI-SMA = smd 1.5 x 2.1: A 1.8,0; C -1.8,0
MALE-PIN-3X7 = drill 0.8 octagon: 1 -7.62,1.27; 2 -5.08,1.27; 3 -2.54,1.27; 4 0,1.27; 5 2.54,1.27; 6 5.08,1.27; 7 7.62,1.27; 8 -7.62,-1.27; 9 -5.08,-1.27; 10 -2.54,-1.27; 11 0,-1.27; 12 2.54,-1.27; 13 5.08,-1.27; 14 7.62,-1.27; 15 -7.62,-3.81; 16 -5.08,-3.81; 17 -2.54,-3.81; 18 0,-3.81; 19 2.54,-3.81; 20 5.08,-3.81; 21 7.62,-3.81
PTC-1206 = smd 1 x 1.8: 1 -1.4,0; 2 1.4,0
JP4Q = drill 0.914 octagon: 1 -3.81,-1.27; 2 -3.81,1.27; 3 -1.27,-1.27; 4 -1.27,1.27; 5 1.27,-1.27; 6 1.27,1.27; 7 3.81,-1.27; 8 3.81,1.27
FIDUCIAL_1MM = smd 1 x 1: 1 0,0
SSOP28 = smd 0.4 x 1.5: 1 -4.225,-3.625; 2 -3.575,-3.625; 3 -2.925,-3.625; 4 -2.275,-3.625; 5 -1.625,-3.625; 6 -0.975,-3.625; 7 -0.325,-3.625; 8 0.325,-3.625; 9 0.975,-3.625; 10 1.625,-3.625; 11 2.275,-3.625; 12 2.925,-3.625; 13 3.575,-3.625; 14 4.225,-3.625; 15 4.225,3.625; 16 3.575,3.625; 17 2.925,3.625; 18 2.275,3.625; 19 1.625,3.625; 20 0.975,3.625; 21 0.325,3.625; 22 -0.325,3.625; 23 -0.975,3.625; 24 -1.625,3.625; 25 -2.275,3.625; 26 -2.925,3.625; 27 -3.575,3.625; 28 -4.225,3.625
2X3-NS = drill 1.016 pad 1.88 square: 1 -2.54,-1.27 | drill 1.016 pad 1.88 octagon: 2 -2.54,1.27; 3 0,-1.27; 4 0,1.27; 5 2.54,-1.27; 6 2.54,1.27
SSR1260 = smd 2.9 x 5.4: A 1.45,2.7; B 11.15,2.7
WUERTH-ELEKTRONIK_1206W = smd 1.6 x 1.8: 1 -1.4,0; 2 1.4,0
CHIP-LED0603 = smd 0.8 x 0.8: A 0,-0.75; C 0,0.75
TO263-5 = smd 1.067 x 2.159: 1 -3.404,-5.791; 2 -1.702,-5.791; 3 0,-5.791; 4 1.702,-5.791; 5 3.404,-5.791 | smd 10.8 x 10.41: 6 0,2.54
CHIP-LED0805 = smd 1.2 x 1.2: A 0,-1.05; C 0,1.05
MICROBUILDER_1206_PTC = smd 1.6 x 1.8: 1 -1.654,0; 2 1.654,0
D2PACK = smd 2.083 x 3.81: 1 -2.54,-8.89; 3 2.54,-8.89 | smd 11.43 x 8.89: 2 0,2.54
SOT23 = smd 1 x 1.4: 1 -0.95,-1.1; 2 0.95,-1.1; 3 0,1.1
R0805 = smd 1.3 x 1.5: 1 -0.85,0; 2 0.85,0
M0805 = smd 1.3 x 1.6: 1 -0.95,0; 2 0.95,0
R0805' = smd 1.3 x 1.5: 1 -0.95,0; 2 0.95,0
TACTILE-SWITCH-SMD = smd 1.524 x 0.762: 1 -2.794,1.905; 2 2.794,1.905; 3 -2.794,-1.905; 4 2.794,-1.905
1X04 = drill 1.016 pad 1.88 square: 1 0,0 | drill 1.016 pad 1.88: 2 2.54,0; 3 5.08,0; 4 7.62,0
SANGUINOLOLU_PLATEDSCREW = drill 3.6: GND 0,0
32005-201 = smd 3.1 x 0.5: 1 3,1.6; 2 3,0.8; 3 3,0; 4 3,-0.8; 5 3,-1.6 | smd 2.5 x 2: M1 -3,-4.45; M2 -3,4.45 | smd 3.3 x 2: M3 2.9,4.45; M4 2.9,-4.45 | hole 0.9: 0,2.2; 0,-2.2
HC49US = drill 0.7 pad 1.651: 1 -2.54,0; 2 2.54,0

### Placement (x,y rotation side)
24V  43.3,10.04 0 top
+5V  43.34,14.89 0 top
+24V  59.59,4.57 180 top
+24V1  48.21,4.57 180 top
ALVL  4.14,40.43 0 top
ATMEGA2560  35,55 225 top
C1  21.68,72.16 225 top
C2  18.55,69.03 45 top
C3  100n  [C0805']  45.97,47.07 45 top
C4  100n  [C0805']  25.88,49.56 135 top
C5  100n  [C0805']  43.84,63.04 45 top
C6  100n  [C0805']  48.23,51.51 45 top
C7  58.82,17.28 180 top
C8  49.88,13.04 0 top
C9  0.1u  [C0805']  9.5,37.02 270 top
C15  0.1u  [C0805']  9.53,46.15 270 top
C20  100n  [C0805']  20.04,9.35 270 top
C21  2.97,14.96 0 top
CARRIAGE0  5.37,81.51 270 top
CARRIAGE1  64.69,82.83 270 top
CARRIAGE2  10.87,80.64 90 top
CARRIAGE3  13.66,80.64 90 top
D1  63.19,17.99 0 top
D3  10.41,31.32 270 top
D8  3.86,21.87 180 top
D9  66.73,10.99 270 top
E0-AXIS  2.62,68.81 90 top
E1-AXIS  67.46,70.15 90 top
E2-AXIS  22.06,93.35 270 top
E3-AXIS  19.24,93.35 270 top
ENDSTOPS  5.46,57.28 270 top
F1  61.72,11.51 90 top
FANS  66.73,63.02 90 top
FID1  12.6,63.83 0 top
FID2  55.47,77.8 0 top
FID3  57.91,43.31 0 top
GND  43.35,12.48 0 top
HOTBED  3.74,33.3 270 top
IC2  12.79,16.51 270 top
ICSP  46.84,70.38 315 top
L1  69.87,30.23 180 top
L2  3.76,18.67 180 top
L4  4.01,7.34 180 top
LCD  22.24,5.56 0 top
LED2  14.4,40.56 270 top
LM2595  49.06,27.85 0 top
LOGO1  27.18,15.09 0 bottom
PRW5  67.82,38.86 90 top
PTC1  3.99,11.43 180 top
PWR24  67.82,37.08 90 top
Q2  19.84,33.14 90 top
Q6  63.33,53.87 270 top
Q7  63.33,50.72 270 top
Q8  63.33,47.42 270 top
R1  26.97,66.79 45 top
R2  4.37,37.62 180 top
R16  32.18,35.36 90 top
R17  32.18,30.3 270 top
R19  18.59,40.56 180 top
R28  4.27,46.41 180 top
R33  19.23,18.21 90 top
R34  21.74,18.21 90 top
R35  20.45,24.89 180 top
R36  20.45,22.61 180 top
R37  36.11,68.83 0 top
R38  4.7K  [R0805']  62.74,36.83 0 top
R39  1K  [R0805']  62.74,38.86 0 top
RESET  36.12,72.55 0 top
RGBLEDS  67.31,54.61 270 top
RXLED  21.74,14.66 180 top
SD  22.24,2.74 0 top
THERM  4.14,43.64 0 top
TXLED  19.2,14.66 180 top
U$1  67.12,86.87 0 top
U$2  67.28,3.38 0 top
U$3  3.07,3.12 0 top
U$4  3.12,86.87 0 top
U$5  [SIGMA_LOGO]  29.58,9.42 0 top
USB  12.76,5.31 90 top
X0-AXIS  30.77,88.25 0 top
X1-AXIS  30.77,85.49 0 top
X2-AXIS  27.7,93.35 270 top
X3-AXIS  24.88,93.35 270 top
Y0-AXIS  46.23,85.52 0 top
Y1  22.6,67.88 45 top
Y1-AXIS  16.46,93.35 270 top
Z-AXIS  46.21,88.28 0 top

### Tracks (layer width: path | path; a pad name or v marks a point on that pad's centre or on a via)
!RESET  (via drill 0.3)
  Top 0.152: v33.69,68.83 v33.68,68.83 | v31.17,64.54 32.43,63.28 ATMEGA2560.30 | ICSP.5 47.74,69.45 49.35,71.07 49.35,71.91 46.51,74.75 45.19,74.75 39.22,68.78 38.3,68.78 v38.25,68.73
  Top 0.305: RESET.2 RESET.1 35.16,72.62 R37.1 v33.69,68.83
  Bottom 0.152: 33.73,68.78 v33.68,68.83 33.78,68.73 v38.25,68.73
  Bottom 0.305: v33.68,68.83 31.17,66.32 v31.17,64.54
+5V  (via drill 0.3, 0.41)  (4 unrouted)
  Top 0.152: IC2.4 7.97,18.79 v7.34,18.16 7.34,20.29 D8.C | C4.1 27.48,48.88 ATMEGA2560.61 29.72,51.12 v29.72,52.07 | 41.45,59.43 ATMEGA2560.10 40.69,58.57 v40.69,58.06 41.3,58.06 43.74,55.63 43.74,54.74 ATMEGA2560.100 | 35.05,55.09 v35.05,54.86 33.07,56.84 33.07,59.74 33.68,60.35 33.68,61.28 ATMEGA2560.31 | ATMEGA2560.80 36.73,47.63 v36.73,48.31 | +5V.TP 44.92,16.46 v46.48,16.46
  Top 0.305: R34.2 22.82,19.16 23.11,18.87 v23.11,18.09 | IC2.20 16.4,15.52 v14.43,15.52 | IC2.19 14.53,14.89 v14.2,14.55 | PRW5.A 68.87,39.74 66.93,41.68 | 66.93,41.68 59.11,41.68 56.24,38.81 56.24,37.03 v56.21,37.01 | E0-AXIS.3 2.13,73.89 0.96,72.72 0.96,65.58 ENDSTOPS.15 | X1-AXIS.3 33.98,83.62 29.7,83.62 29.2,84.12 29.2,87.47 28.39,88.27 X2-AXIS.3 | 66.93,41.68 69.49,44.25 69.49,62.79 FANS.5 | C5.1 42.52,61.72 42.52,60.35 41.5,59.33 ATMEGA2560.10
  Top 0.406: R2.2 3.19,37.85 v1.52,37.85 | R28.2 3.24,46.48 v1.27,46.48 | IC2.19 IC2.20 | v44.96,49.02 44.96,46.74 C3.1 45.87,45.82 v45.87,42.98 | E1-AXIS.3 68.15,75.23 69.19,74.19 69.19,68.02 FANS.7
  Top 0.61: Z-AXIS.3 51.31,88.25 Y0-AXIS.3 | CARRIAGE1.4 64.58,75.23 E1-AXIS.3 | FANS.7 FANS.5 | CARRIAGE0.4 E0-AXIS.3
  Top 0.813: R34.2 R33.2 | X0-AXIS.3 X1-AXIS.3
  Top 1.016: LM2595.4 50.76,19.6 v51.56,18.8 | C8.+ 51.16,14.88 v50.04,14.88 | CARRIAGE2.4 CARRIAGE3.4 13.67,88.27 Y1-AXIS.3 E3-AXIS.3 E2-AXIS.3 X3-AXIS.3 X2-AXIS.3
  Top 1.27: L1.B 58.93,27.73 v58.93,32.51
  Bottom 0.152: v7.34,18.16 7.34,17.63 7.32,17.6 | v36.73,48.31 36.73,50.9 38.76,52.93 | v29.72,52.07 32.51,54.86 v35.05,54.86 35.66,55.47 38.1,55.47 v40.69,58.06 | v46.48,16.46 46.63,16.61 47.24,16.61
  Bottom 0.305: v23.11,18.09 23.11,17.7 23.14,17.68 | v14.43,15.52 14.4,15.49 13.92,15.49 | v14.2,14.55 13.74,14.55 13.69,14.61 | v56.21,37.01 56.21,35.97
  Bottom 0.406: v1.52,37.85 1.27,38.1 1.27,38.61 | v1.27,46.48 1.27,45.72 | v44.96,49.02 42.67,49.02 38.76,52.93 36.83,54.86 v35.05,54.86 | v45.87,42.98 49.02,39.98 v49.02,36.83
  Bottom 1.016: v51.56,18.8 51.56,17.27 | v50.04,14.88 48.82,16.1 48.82,16.23
  Bottom 1.27: v58.93,32.51 58.67,32.77 58.67,34.54
  other vias: 43.69,36.83 45.47,36.83 50.8,36.83 52.58,36.83 54.36,36.83
  pour Bottom: 0.76,66.04 2.03,66.04 2.03,18.29 23.62,18.29 23.62,7.37 42.16,7.37 42.16,38.1 60.45,38.1 60.45,24.13 53.59,24.13 53.59,8.38 45.97,8.38 45.97,1.27 9.91,1.27 9.91,8.64 0.76,8.64
+24V  (via drill 0.3, 0.36)
  Top 0.152: 24V.TP 44.24,10.97 58.06,10.97 59.11,12.01 v60.05,12.01
  Top 0.254: v68.43,35.84 66.83,34.24 65.15,34.24 64.52,33.6 64.52,25.63 60.31,21.43 60.31,19.95 v60.96,19.3
  Top 0.305: PWR24.A 68.87,36.28 v68.43,35.84 | LED2.A 12.62,40.56 11.96,39.9 11.96,34.77 D3.C
  Top 0.406: v60.96,19.3 60.31,18.66 C7.1 58.53,15.49 55.12,15.49 53.72,16.89 50.67,16.89 47.14,20.42 46.18,20.42 45.65,20.94 LM2595.1
  Top 1.016: D3.C 10.33,33.3 HOTBED.1
  Bottom 0.305: v68.43,35.84 68,35.84 67.94,35.89
  Bottom 0.406: v60.96,19.3 61.21,19.3 61.47,19.05
  other vias: 60.05,13.54 60.05,12.78 63.42,13.56 63.42,12.8 63.42,12.04 64.87,13.59 64.87,12.83 64.87,12.06 68.43,13.59 68.43,12.83 68.43,12.06
  pour Bottom: 63.75,5.08 69.34,10.67 69.34,80.77 60.96,89.15 28.89,89.46 28.89,94.77 9.31,94.77 9.31,87.03 1.54,82.92 1.52,66.8 7.11,66.8 7.87,67.56 7.87,78.99 12.19,83.31 61.21,83.31 62.23,82.3 62.23,68.58 62.99,67.82 62.99,57.66 65.79,54.86 65.79,25.4 58.93,18.54 59.18,6.6 46.74,6.6 46.74,2.29 63.5,2.29
  pour Bottom: 5.08,72.64 11.43,72.64 11.43,30.99 2.79,30.99 2.79,35.31 8.64,35.31 8.38,66.8 4.83,66.8
  pour Top: 59.61,14.02 68.99,14 68.99,11.58 59.61,11.56
AUTO_LEVEL  (via drill 0.3)
  Top 0.152: C9.1 9.5,41.76 v13.08,45.34 | v40.72,46.63 40.53,46.63 ATMEGA2560.84
  Top 0.406: ALVL.1 5.32,37.97 R2.1 9.15,37.62 C9.1
  Bottom 0.152: v13.08,45.34 39.42,45.34 v40.72,46.63
B-PWM  (via drill 0.3)
  Top 0.152: ATMEGA2560.26 32.77,65.71 32.77,66.04 31.45,67.36 31.45,76.43 33.35,78.33 41.76,78.33 v42.06,78.79 | Q8.1 61.66,48.38 61.11,48.92 61.11,49.68 60.5,50.29 60.5,55.63 61.27,56.39 61.27,61.57 57.3,65.53 56.84,65.53 56.24,66.14 56.24,66.9 56.69,67.36 v56.69,68.73
  Bottom 0.152: v42.06,78.79 42.37,78.79 42.67,78.33 46.63,78.33 56.08,68.89 56.54,68.89 v56.69,68.73
BED_THERM  (via drill 0.3)
  Top 0.152: C15.1 v12.94,47.1 | v38.3,51.66 39.05,51.66 ATMEGA2560.89
  Top 0.406: THERM.1 5.22,45.98 R28.1 5.91,47.1 C15.1
  Bottom 0.152: v38.3,51.66 39.05,51.66 41.66,49.06 41.66,48.72 38.79,45.85 14.2,45.85 v12.94,47.1
E0-!EN  (via drill 0.3)
  Top 0.152: v17.55,44.81 19.33,46.58 19.79,46.58 20.24,47.04 20.24,52.93 19.99,53.19 v19.99,53.42 | v7.75,73.64 6.22,75.16 3.99,75.16 2.72,76.43 E0-AXIS.4 | ATMEGA2560.76 36.73,44.79 36.73,44.35 36.42,44.04 v36.42,43.13
  Bottom 0.152: v17.55,44.81 16.87,44.12 16.87,43.61 17.3,43.18 19.18,43.18 19.41,43.41 36.14,43.41 v36.42,43.13 | v7.75,73.64 8.31,73.08 8.31,71.32 20.27,59.36 20.27,55.22 19.99,54.94 v19.99,53.42
E1-!EN  (via drill 0.3)
  Top 0.152: v55.78,51.36 56.01,51.36 56.64,51.99 56.64,52.86 56.26,53.24 56.26,56.21 v56.39,56.34 | v63.12,76.5 66.19,76.5 E1-AXIS.4 | ATMEGA2560.75 31.7,43.22 v31.7,42.82
  Bottom 0.152: v55.78,51.36 55.17,51.36 47.4,43.59 39.09,43.59 38.89,43.38 37.62,43.38 36.75,42.52 36.12,42.52 35.66,42.98 32.31,42.98 32.16,42.82 v31.7,42.82 | v56.39,56.34 56.39,57.4 55.91,57.89 55.91,60.76 62.76,67.61 62.76,76.15 v63.12,76.5
E2-!EN  (via drill 0.3)
  Top 0.152: E2-AXIS.4 23.18,84.6 v23.47,84.32 | v33.07,60.66 33.07,60.5 32.61,60.05 32.16,60.05 30.33,58.22 30.33,56.08 34.59,51.82 34.59,46.79 33.52,45.71 ATMEGA2560.74
  Bottom 0.152: v33.07,60.66 33.07,61.72 29.11,65.68 29.11,67.82 23.47,73.46 v23.47,84.32
E3-!EN  (via drill 0.3)
  Top 0.152: ATMEGA2560.73 34.29,47.21 34.29,51.66 30.02,55.93 30.02,58.37 32.31,60.66 v32.31,60.96
  Bottom 0.152: E3-AXIS.4 20.57,84.4 20.57,79.55 20.88,79.25 20.88,75.59 28.8,67.67 28.8,65.53 32.31,62.03 v32.31,60.96
E-DIR  (via drill 0.3)
  Top 0.152: ATMEGA2560.77 37.06,45.15 v37.06,43.74 | v20.6,54.56 20.6,46.74 19.99,46.13 19.36,46.13 18.75,45.52 18.75,44.88 18.57,44.7 18.31,44.7 v17.6,43.99 | v6.3,80.24 3.89,80.24 E0-AXIS.5 | v55.83,52.43 55.83,56.92 v55.63,57.12 | E1-AXIS.5 66.06,78.99 63.83,78.99 63.22,78.31 v62.89,78.31 | E3-AXIS.5 20.57,84.52 v20.57,87.02 | v20.57,89.46 9.75,89.46 9.14,88.85 9.14,86.87 7.01,84.73 v7.01,83.36
  Top 1.016: E2-AXIS.5 E3-AXIS.5
  Bottom 0.152: v37.06,43.74 37.03,43.71 | v20.6,54.56 20.6,59.59 8.76,71.42 8.76,73.86 7.16,75.46 7.16,79.38 v6.3,80.24 6.33,80.24 7.01,80.92 v7.01,83.36 | 37.03,43.71 38.73,43.71 38.91,43.89 47.02,43.89 55.24,52.12 55.52,52.12 v55.83,52.43 | v55.63,57.12 55.4,57.35 55.4,60.78 62.31,67.69 62.31,78.31 v62.89,78.31 | 37.03,43.71 19.23,43.71 19.02,43.51 17.78,43.51 17.78,43.81 v17.6,43.99 | v20.57,87.02 v20.57,89.46
E-STEP  (via drill 0.3)
  Top 0.152: ATMEGA2560.78 38.08,44.85 v38.08,44.27 | v18.67,44.12 19.13,44.58 19.13,45.21 19.58,45.67 20.14,45.67 21.13,46.66 v21.13,55.5 | v55.04,53.16 55.04,56.13 v55.02,56.16 | v62.71,81.56 66.17,81.56 E1-AXIS.6 | 8.18,82.42 7.16,82.42 6.78,82.8 4.06,82.8 2.77,81.51 E0-AXIS.6 | 8.18,82.42 8.61,81.99 8.61,81.05 8,80.44 v7.54,80.44 | 8.18,82.42 8.18,85.34 9.91,87.07 17.55,87.07 18.01,86.61 18.01,84.61 v17.83,84.43
  Top 1.016: E2-AXIS.6 E3-AXIS.6
  Bottom 0.152: v7.54,80.44 7.54,75.77 9.27,74.04 9.27,71.48 21.13,59.61 21.13,57.51 21.01,57.38 21.01,55.63 v21.13,55.5 | v55.04,53.16 55.04,52.48 46.84,44.27 v38.08,44.27 37.34,44.27 37.24,44.37 20.62,44.37 20.3,44.04 18.75,44.04 v18.67,44.12 | v55.02,56.16 55.02,61.04 61.87,67.89 61.87,80.72 v62.71,81.56 | v17.83,84.43 17.83,82.06 E3-AXIS.6
G-PWM  (via drill 0.3)
  Top 0.152: ATMEGA2560.24 37.34,65.13 37.34,66.04 36.83,66.55 33.78,66.55 32.26,68.07 32.26,75.95 33.53,77.22 v42.11,77.22 | v57.4,66.55 62.23,61.72 Q6.1
  Bottom 0.152: v42.11,77.22 42.47,77.22 42.82,77.57 46.38,77.57 56.87,67.08 v57.4,66.55
GND  (via drill 0.36, 0.41)  (3 unrouted)
  Top 0.152: ATMEGA2560.99 44.21,53.51 44.2,53.49 44.81,52.88 46.33,52.88
  Top 0.813: LM2595.5 55.67,22.05 56.39,21.34 56.39,18.21 C7.2
  other vias: 2.29,93.73 4.32,93.73 6.35,93.73 2.29,91.69 4.32,91.69 6.35,91.69 6.35,89.66 7.37,87.63 14.94,61.26 17.68,57.15 17.53,53.64 28.19,55.02 58.67,60.05 53.34,64.77 51.21,61.57 58.67,70.87 54.41,74.83 63.86,88.54 58.37,47.4 62.18,43.74 37.19,36.58 37.34,31.7 37.34,28.19 49.68,43.13 13.56,42.67 21.49,40.08 27.74,39.32 27.43,35.81 25.3,39.32 14.02,24.38 8.84,23.93 24.08,20.57 21.34,26.37 30.33,27.13 26.06,26.67 62.79,34.75 62.79,27.13 56.85,20.88 56.39,14.02 47.4,53.19 46.63,49.68 39.78,72.39 39.78,76.05
  pour Top (rank 6): -0.77,96.52 70.6,96.52 70.87,-0.76 -0.51,-0.76
  pour Bottom (isolate 0.305, rank 6): -0.15,95.83 70.61,95.99 70.71,-0.15 -0.05,-0.3
HOTEND0  (via drill 0.3)
  Top 0.152: ATMEGA2560.18 36.55,60.07 v35.97,60.07 | v9.17,77.19 7.16,77.19 CARRIAGE0.2
  Bottom 0.152: v35.97,60.07 35.28,60.07 34.72,59.51 32.79,59.51 27.36,64.95 24.03,64.95 22.07,62.99 19.41,62.99 12.65,69.75 12.65,74.57 10.16,77.06 9.3,77.06 v9.17,77.19
HOTEND1
  Top 0.152: ATMEGA2560.16 44.58,66.7 46.74,66.7 47.17,66.27 48.77,66.27 61.49,78.99 62.99,78.99 64.29,80.29 CARRIAGE1.2
LCDRESET  (via drill 0.3)
  Top 0.152: ATMEGA2560.47 25.48,58.17 25.32,58.17 22.99,55.83 22.99,41.58 23.32,41.25 33.15,41.25 35.71,38.68 35.71,26.9 29.06,20.24 29.06,9.88 29.52,9.42 v29.52,9.14
  Bottom 0.152: v29.52,9.14 25.83,9.14 LCD.1
LCDRX  (via drill 0.3)
  Top 0.152: ATMEGA2560.46 25.56,58.8 25.3,58.8 22.53,56.03 22.53,41.38 23.11,40.79 32.89,40.79 35.28,38.41 35.28,27.05 28.65,20.42 28.65,8.38 v28.98,8.05
  Bottom 0.152: v28.98,8.05 27.27,8.05 LCD.2
LCDTX
  Top 0.152: ATMEGA2560.45 25.76,59.28 25.17,59.28 22.1,56.21 22.1,41.17 22.94,40.34 32.69,40.34 34.8,38.23 34.8,27.18 28.25,20.62 28.25,6.48 LCD.3
LFAN0  (via drill 0.3)
  Top 0.152: ATMEGA2560.17 36.37,59.21 v36.04,59.21 | v9.8,76.12 9.49,76.43 CARRIAGE0.3
  Bottom 0.152: v36.04,59.21 32.61,59.21 27.2,64.62 24.18,64.62 22.2,62.64 19.28,62.64 12.27,69.65 12.27,74.42 10.57,76.12 v9.8,76.12
LFAN1
  Top 0.152: ATMEGA2560.15 44.84,66.24 46.53,66.24 47.09,65.68 48.87,65.68 60.94,77.75 CARRIAGE1.3
MISO  (via drill 0.3)
  Top 0.152: ICSP.1 43.33,70.46 43.33,69.67 37.23,63.57 ATMEGA2560.22 | v51.36,51.97 51.36,50.14 52.27,49.23 52.27,41.91 50.44,40.08 41.45,40.08 39.47,38.1 39.47,25.91 38.71,25.15 38.71,17.37 34.75,13.41 34.75,7.77 33.68,6.71 33.68,1.37 33.22,0.91 28.8,0.91 28.19,1.52 28.19,1.87 SD.3
  Bottom 0.152: ICSP.1 44.55,70.87 46.33,70.87 48.92,68.28 48.92,66.75 48.31,66.14 48.31,55.32 51.36,52.27 v51.36,51.97
MOSI  (via drill 0.3)
  Top 0.152: ICSP.4 47.53,71.07 45.85,71.07 43.99,69.22 43.56,69.22 37.57,63.22 ATMEGA2560.21 | SD.2 24.79,1.28 25.45,0.61 35.36,0.61 36.58,1.83 36.58,6.4 35.2,7.77 35.2,13.41 39.01,17.22 39.01,24.99 39.78,25.76 39.78,37.95 41.6,39.78 50.6,39.78 52.58,41.76 52.58,49.38 51.97,49.99 51.97,53.03 v50.44,54.56
  Bottom 0.152: ICSP.4 49.88,71.27 51.05,70.1 51.05,68.89 49.38,67.21 49.38,66.6 48.62,65.84 48.62,55.47 49.53,54.56 v50.44,54.56
N$1
  Top 0.152: ATMEGA2560.33 31.37,62.18 28.27,65.28 28.27,66.69 R1.2 25.29,69.68 Y1.2 24.4,70.65 C1.1
N$2
  Top 0.152: ATMEGA2560.98 43.93,53.1 44.91,52.12 46.79,52.12 47.56,51.34 C6.1
N$3
  Top 0.152: ATMEGA2560.34 27.64,65.2 27.36,65.2 R1.1 25.94,66.19 24.54,67.59 22.31,67.59 Y1.1 20.3,66.09 C2.1
N$4
  Top 0.406: L1.A 68.42,23.22 D1.C 62.99,17.79 62.99,16 61.72,14.73 54.61,14.73 53.37,15.98 50.65,15.98 46.81,19.81 45.72,19.81 45.11,20.42 44.65,20.42 44.35,20.73 44.35,23.32 44.81,23.77 46.79,23.77 47.36,23.2 LM2595.2
N$5
  Top 0.305: C21.1 1.97,11.79 PTC1.2
  Top 0.406: L2.2 1.97,18.28 C21.1
N$6  (via drill 0.3)
  Top 0.152: IC2.23 17.41,17.49 v17.78,17.12 | v20.24,14.4 19.7,14.4 TXLED.C
  Bottom 0.152: v17.78,17.12 19.02,17.12 20.24,15.9 v20.24,14.4
N$7
  Top 0.152: IC2.22 17.2,16.84 17.7,16.33 17.7,16.1 17.96,15.85 17.96,13.95 18.95,12.95 20.79,12.95 RXLED.C
N$9
  Top 0.61: Q6.3 66.24,52.07 RGBLEDS.2
N$10
  Top 0.61: Q7.3 65.62,49.53 RGBLEDS.3
N$11
  Top 0.61: Q8.3 64.86,46.99 RGBLEDS.4
N$25
  Top 1.676: F1.1 61.72,6.71 +24V.1 57.17,2.16 50.22,2.16 48.21,4.16 +24V1.1
N$63
  Top 1.016: R16.1 R17.1
  Top 1.27: R17.1 31.48,31.95 28.73,31.95 Q2.1
N$66
  Top 1.27: D3.A 10.41,27 | R19.1 19.54,35.38 Q2.2
  Top 2.54: HOTBED.2 5.04,27 10.41,27 13,27 17,31 17,32 17.3,32.3 Q2.2
N$69
  Top 0.406: R19.2 LED2.C
N$76
  Top 0.305: IC2.17 17.55,13.59 17.93,13.21 17.93,11.48 18.24,11.18 18.97,11.18 19.85,10.3 C20.1
N$81
  Top 0.152: TXLED.A 19.2,17.24 R33.1
N$82
  Top 0.152: RXLED.A R34.1
N$83
  Top 0.152: L2.1 3.68,20.14 2.64,20.14 2.13,20.65 2.13,21.7 D8.A
N$84
  Top 0.305: USB.1 11.16,10.3 10.64,10.82 6.4,10.82 PTC1.1
N$161
  Top 0.305: R38.2 66.77,36.83 PWR24.C
N$162
  Top 0.406: R39.2 PRW5.C
PWM_HOTBED  (via drill 0.3)
  Top 0.152: ATMEGA2560.1 45.48,57 49.38,57 53.03,53.34 53.03,40.69 51.36,39.01 42.67,39.01 42.52,39.17 v42.22,39.17 | v33.22,38.86 32.18,37.82 R16.2
  Bottom 0.152: v42.22,39.17 33.53,39.17 v33.22,38.86
R-PWM  (via drill 0.3)
  Top 0.152: ATMEGA2560.25 36.83,65.31 36.83,65.79 36.58,66.04 33.53,66.04 31.75,67.82 31.75,76.2 33.53,77.98 v42.16,77.98 | Q7.1 62.08,51.82 61.21,51.82 60.96,52.07 60.96,55.37 61.72,56.13 61.72,61.72 57.45,65.99 57,65.99 56.69,66.29 56.69,66.75 57.3,67.36 v57.3,67.82
  Bottom 0.152: v42.16,77.98 46.49,77.98 55.83,68.64 55.87,68.64 56.39,68.12 57,68.12 v57.3,67.82
RX
  Top 0.305: IC2.1 12.91,20.74 16.05,23.88 18.48,23.88 R35.2
RX0  (via drill 0.3)
  Top 0.305: R35.1 v29.95,24.89 | ATMEGA2560.2 44.29,56.5 45.24,57.45 49.58,57.45 53.49,53.54 53.49,40.41 51.64,38.56 41.6,38.56 40.69,37.64 40.69,25.3 40.84,25.15 v40.84,24.54
  Bottom 0.305: v40.84,24.54 40.49,24.89 v29.95,24.89
SCLK  (via drill 0.3, 0.36)
  Top 0.152: ATMEGA2560.20 37.95,62.87 43.18,68.1 44.56,68.1 ICSP.3 v45.97,69.44 | SD.4 31.09,3.97 31.09,6.71 31.24,6.86 31.24,7.32 34.44,10.52 34.44,13.56 38.41,17.53 38.41,25.3 39.17,26.06 39.17,38.25 41.3,40.39 50.29,40.39 51.97,42.06 51.97,49.07 50.75,50.29 v50.75,51.51
  Bottom 0.152: v45.97,69.44 45.97,67.31 48.01,65.28 48.01,54.25 50.37,51.89 v50.75,51.51
SDSS  (via drill 0.3)
  Top 0.152: SD.1 23.62,4.12 28.04,4.12 28.65,4.72 28.65,6.55 v29.87,7.77 | ATMEGA2560.19 42.97,67.21 v43.43,67.21 | v45.87,60.05 47.4,58.52 56.39,58.52 57,57.91 57,51.36 54.71,49.07 54.71,48.62 v55.02,48.31 | v51.36,46.79 51.51,46.79 51.66,46.63 51.66,42.22 50.14,40.69 41.15,40.69 38.86,38.41 38.86,26.21 38.1,25.45 38.1,17.68 34.14,13.72 34.14,11.73 v33.68,11.28
  Bottom 0.152: v45.87,60.05 46.18,60.35 46.18,64.62 43.59,67.21 v43.43,67.21 | v51.36,46.79 51.66,47.09 51.66,47.24 53.95,47.24 v55.02,48.31 | v33.68,11.28 30.18,7.77 v29.87,7.77
THERM0  (via drill 0.3)
  Top 0.152: ATMEGA2560.87 42.04,47.24 v42.04,46.35 | v19.96,44.76 21.72,46.38 v21.72,57.02 | v7.67,81.58 5.45,81.58 CARRIAGE0.1
  Bottom 0.152: v42.04,46.35 40.39,44.76 38.84,44.76 38.63,44.96 20.17,44.96 v19.96,44.76 | v21.72,57.02 21.72,59.72 9.91,71.45 9.91,74.19 8.23,75.87 8.23,81.03 v7.67,81.58
THERM1  (via drill 0.3)
  Top 0.152: ATMEGA2560.88 42.15,47.85 v43.64,47.85 | v62.13,83.19 64.34,83.19 CARRIAGE1.1
  Bottom 0.152: v43.64,47.85 49.81,47.85 54.36,52.4 54.36,60.96 61.49,67.94 61.49,82.55 v62.13,83.19
THERM2  (via drill 0.3)
  Top 0.152: ATMEGA2560.86 38.76,49.84 38.25,49.84 32.31,55.78 v32.16,55.78 | v23.77,61.87 23.77,61.72 23.16,61.11 21.64,61.11 21.03,61.72 21.03,62.18 16,67.21 16,71.32 15.39,71.93 v15.39,73
  Bottom 0.152: v32.16,55.78 31.09,56.84 31.09,57.3 31.7,57.91 31.7,58.67 26.67,63.7 24.69,63.7 23.77,62.79 v23.77,61.87 | v15.39,73 15.85,73.46 15.85,78.18 15.39,78.64 14.94,78.64 14.33,79.25 12.04,79.25 10.87,80.41 CARRIAGE2.1
THERM3  (via drill 0.3)
  Top 0.152: v16,72.24 16,72.08 16.31,71.78 16.31,67.36 21.49,62.18 21.49,61.72 21.79,61.42 22.55,61.42 v23.01,61.87 | ATMEGA2560.85 39.33,48.61 38.56,49.38 38.25,49.38 32.46,55.17 31.85,55.17 31.55,55.47 31.55,56.84 v31.7,57
  Bottom 0.152: CARRIAGE3.1 13.66,80.52 15.24,78.94 16,78.94 16.15,78.79 16.15,73.3 16,73.15 v16,72.24 | v23.01,61.87 23.01,62.48 24.54,64.01 26.82,64.01 32,58.83 32,57.15 31.85,57 v31.7,57
TX
  Top 0.305: IC2.5 11.38,18.14 15.29,22.05 18.94,22.05 R36.2
TX0  (via drill 0.3)
  Top 0.305: R36.1 22.59,23.8 v28.12,23.8 | ATMEGA2560.3 45.17,58.09 50.01,58.09 54.2,53.9 54.2,39.78 52.38,37.95 42.52,37.95 41.45,36.88 v41.45,23.01
  Bottom 0.305: v41.45,23.01 40.66,23.8 v28.12,23.8
USBD+
  Top 0.406: IC2.15 15.08,12.29 12.7,9.91 12.7,8.37 USB.3
USBD-
  Top 0.406: IC2.16 14.46,12.94 11.94,10.41 11.94,8.33 USB.2
USBSHIELD
  Top 0.61: USB.5 14.46,8.21 USB.M4
  Top 1.27: L4.1 7.44,7.34 USB.M3
  pour Top (no thermals): 16,10.41 18.54,10.41 18.54,0.76 6.86,0.76 6.86,10.16 10.41,10.16 10.41,6.35 15.75,6.35 15.75,10.41
X0-!EN  (via drill 0.3)
  Top 0.152: ATMEGA2560.94 43.64,50.6 v45.11,50.6 | X0-AXIS.4 39.58,89.43 44.58,89.43 44.83,89.18 44.83,84.94 43.59,83.69 43.59,77.42 v43.89,77.11
  Bottom 0.152: v45.11,50.6 45.11,52.43 47.4,54.71 47.4,65.08 42.55,69.93 42.55,70.26 42.49,72.34 42.49,72.82 43.28,73.61 43.28,74.68 43.59,74.98 43.59,76.81 v43.89,77.11
X0-STOP  (via drill 0.3)
  Top 0.152: ATMEGA2560.63 30.5,50.51 v30.5,51.64 | v12.17,58.62 6.73,64.06 ENDSTOPS.1
  Bottom 0.152: v30.5,51.64 28.22,49.35 16.92,49.35 15.21,51.05 15.21,55.58 v12.17,58.62 12.17,58.5
X1-!EN  (via drill 0.3)
  Top 0.152: X1-AXIS.4 38.39,84.87 39.55,83.72 42.01,83.72 42.75,82.98 42.75,75.92 v42.52,75.69 | v40.59,53.01 40.59,52.93 ATMEGA2560.93
  Bottom 0.152: v42.52,75.69 41.53,74.7 41.53,69.88 46.66,64.75 46.66,59.38 46.3,59.03 45.39,59.03 42.8,56.44 42.8,55.22 v40.59,53.01
X1-STOP  (via drill 0.3)
  Top 0.152: ATMEGA2560.64 31.62,50.91 v31.62,51.49 | v12.19,57.53 11.56,57.53 ENDSTOPS.2
  Bottom 0.152: v31.62,51.49 31.32,51.49 28.73,48.9 16.56,48.9 14.61,50.85 14.61,55.12 v12.19,57.53
X2-!EN  (via drill 0.3)
  Top 0.152: v35.51,63.09 35.2,62.79 35.2,57.63 ATMEGA2560.92
  Bottom 0.152: v35.51,63.09 36.42,64.01 36.42,65.53 39.17,68.28 39.17,69.49 29.41,79.25 26.98,79.25 26.52,79.7 26.52,84.73 27.51,85.73 X2-AXIS.4
X2-STOP  (via drill 0.3)
  Top 0.152: ATMEGA2560.67 33.33,50.49 v33.66,50.49 | v12.22,52.6 8.87,52.6 ENDSTOPS.5
  Bottom 0.152: v33.66,50.49 33.3,50.49 30.4,47.6 15.49,47.6 12.88,50.22 12.88,51.94 v12.22,52.6
X3-!EN  (via drill 0.3)
  Top 0.152: ATMEGA2560.91 34.9,57.22 34.9,64.77 35.51,65.38 v35.81,65.38
  Bottom 0.152: v35.81,65.38 38.86,68.43 38.86,69.34 29.26,78.94 26.82,78.94 26.21,79.55 26.21,84.73 25.22,85.73 X3-AXIS.4
X3-STOP  (via drill 0.3)
  Top 0.152: v12.17,51.05 7.87,51.05 ENDSTOPS.6 | ATMEGA2560.68 33.13,49.61 v33.4,49.61
  Bottom 0.152: v33.4,49.61 33.12,49.61 30.68,47.17 15.11,47.17 12.22,50.06 12.22,51 v12.17,51.05
X-DIR  (via drill 0.3)
  Top 0.152: X1-AXIS.5 43.16,83.27 43.16,75.08 42.67,74.6 v42.67,74.55 | v41.81,53.31 41.81,53.15 ATMEGA2560.95 | X1-AXIS.5 39.55,86.88 37.69,86.88 37.11,86.3 37.11,84.31 35.98,83.19 X2-AXIS.5
  Top 0.406: X1-AXIS.5 X0-AXIS.5
  Top 1.016: X2-AXIS.5 X3-AXIS.5
  Bottom 0.152: v42.67,74.55 42.67,73.97 42.42,73.71 42.42,73.23 41.83,72.64 41.83,70.03 46.99,64.87 46.99,54.76 45.97,53.75 42.24,53.75 v41.81,53.31
X-STEP  (via drill 0.3)
  Top 0.152: v41.76,55.02 42.37,54.41 42.37,53.34 43.21,52.5 ATMEGA2560.96
  Top 0.406: X0-AXIS.6 X1-AXIS.6
  Top 1.016: X3-AXIS.6 X2-AXIS.6
  Bottom 0.152: 41.91,82.8 41.15,82.04 41.15,69.65 42.82,67.97 42.82,66.75 43.13,66.45 43.74,66.45 45.72,64.47 45.72,60.66 45.57,60.5 45.41,60.5 45.11,60.2 45.11,59.74 44.5,59.13 44.5,58.67 42.37,56.54 42.37,55.63 v41.76,55.02
  Bottom 0.254: X2-AXIS.6 29.85,82.8 41.91,82.8 43.47,84.37 X1-AXIS.6
Y0-!EN  (via drill 0.3)
  Top 0.152: Y0-AXIS.4 56.16,83.21 57.76,83.21 v58.37,82.6 | ATMEGA2560.6 44.81,59.85 44.81,60.35 59.59,75.13 v59.59,75.59
  Bottom 0.152: v58.37,82.6 58.98,81.99 58.98,76.5 59.59,75.89 v59.59,75.59
Y0-STOP  (via drill 0.3)
  Top 0.152: ATMEGA2560.65 32.54,51.14 v32.54,51.49 | v12.17,55.96 10.59,55.96 ENDSTOPS.3
  Bottom 0.152: v32.54,51.49 32.54,51.13 29.82,48.41 16.23,48.41 13.92,50.72 13.92,54.2 v12.17,55.96
Y1-!EN  (via drill 0.3)
  Top 0.152: ATMEGA2560.7 44.5,60.26 v44.5,60.96 | v31.24,78.18 30.94,78.49 15.7,78.49 15.24,78.94 15.24,84.73 16.23,85.73 Y1-AXIS.4
  Bottom 0.152: v44.5,60.96 45.41,61.87 45.41,64.31 43.59,66.14 42.98,66.14 42.52,66.6 42.52,67.82 40.69,69.65 39.47,69.65 31.24,77.88 v31.24,78.18
Y1-STOP  (via drill 0.3)
  Top 0.152: ATMEGA2560.66 v33.53,51.41 | v12.17,54.41 9.6,54.41 ENDSTOPS.4
  Bottom 0.152: v33.53,51.41 30.15,48.03 15.85,48.03 13.46,50.42 13.46,53.11 v12.17,54.41
Y-DIR  (via drill 0.3)
  Top 0.152: ATMEGA2560.5 45.26,59.62 45.26,60.35 60.2,75.29 v60.2,76.05 | Y0-AXIS.5 56.39,85.34 v59.28,82.45 59.28,81.53 58.67,80.92 56.39,80.92 v55.32,81.99 | v42.06,81.99 41.6,81.99 41.15,81.53 28.96,81.53 28.5,81.99 17.66,81.99 Y1-AXIS.5
  Bottom 0.152: v59.28,82.45 59.28,76.96 v60.2,76.05 | v55.32,81.99 54.71,81.99 54.25,81.53 42.52,81.53 v42.06,81.99
Y-STEP  (via drill 0.3)
  Top 0.152: v33.22,55.63 34.75,54.1 37.3,54.1 ATMEGA2560.90 | v22.1,62.03 16.61,67.51 v16.61,72.85 | Y0-AXIS.6 59.89,84.56 59.89,80.62 59.59,80.31 56.08,80.31 v55.17,81.23 | v41.91,81.23 30.63,81.23 28.19,78.79 17.98,78.79 16.46,80.31 Y1-AXIS.6
  Bottom 0.152: v33.22,55.63 32.31,56.54 32.31,58.98 26.98,64.31 24.38,64.31 v22.1,62.03 | v16.61,72.85 16.61,80.5 Y1-AXIS.6 | v41.91,81.23 54.71,81.23 v55.17,81.23
Z-!EN  (via drill 0.3)
  Top 0.152: Z-AXIS.4 52.58,87.03 52.58,84.28 53.03,83.82 54.86,83.82 56.08,82.6 57.61,82.6 v58.37,81.84 | v45.87,51.66 44.69,51.66 ATMEGA2560.97
  Bottom 0.152: v58.37,81.84 58.37,81.53 58.67,81.23 58.67,75.29 59.89,74.07 60.2,74.07 60.5,73.76 60.5,68.58 53.34,61.42 53.34,52.88 50.44,49.99 47.85,49.99 46.18,51.66 v45.87,51.66
Z-DIR  (via drill 0.3)
  Top 0.152: ATMEGA2560.71 30.63,44.99 30.63,42.37 31.24,41.76 32.46,41.76 32.61,41.91 46.33,41.91 48.31,43.89 48.31,48.01 48.92,48.62 v48.92,48.92 | v60.2,79.55 60.81,80.16 60.81,83.06 61.11,83.36 61.11,86.56 60.81,86.87 58.06,86.87 56.66,88.28 Z-AXIS.5
  Bottom 0.152: v48.92,48.92 49.07,48.77 49.68,48.77 53.65,52.73 53.65,61.27 60.81,68.43 60.81,78.79 60.2,79.4 v60.2,79.55
Z-STEP  (via drill 0.3)
  Top 0.152: Z-AXIS.6 60.47,88.28 61.57,87.17 61.57,83.21 61.11,82.75 61.11,79.55 v60.96,79.4 | v48.01,48.62 48.01,44.22 46.13,42.34 32.28,42.34 32.16,42.22 31.39,42.22 31.09,42.52 31.09,44.73 ATMEGA2560.72
  Bottom 0.152: v60.96,79.4 61.11,79.25 61.11,68.28 54.03,61.19 54.03,52.58 49.66,48.21 48.41,48.21 v48.01,48.62
Z-STOP  (via drill 0.3)
  Top 0.152: v12.19,49.28 11.81,49.66 ENDSTOPS.7 | ATMEGA2560.69 32.91,48.67 v33.25,48.67
  Bottom 0.152: v12.19,49.28 14.73,46.74 30.99,46.74 32.92,48.67 v33.25,48.67

### Text on the board
tPlace: ATmega2560 | RepRapBCN / BCN3DSigma
bPlace: BCNelectronics - RepRapBCN / Designed in Barcelona / ---------------------------------- / Sigma MotherBoard / Marc Cobler - REV_A / Nov 2014